# Altium project PowerBoard.PrjPcb (part 1 of 2)
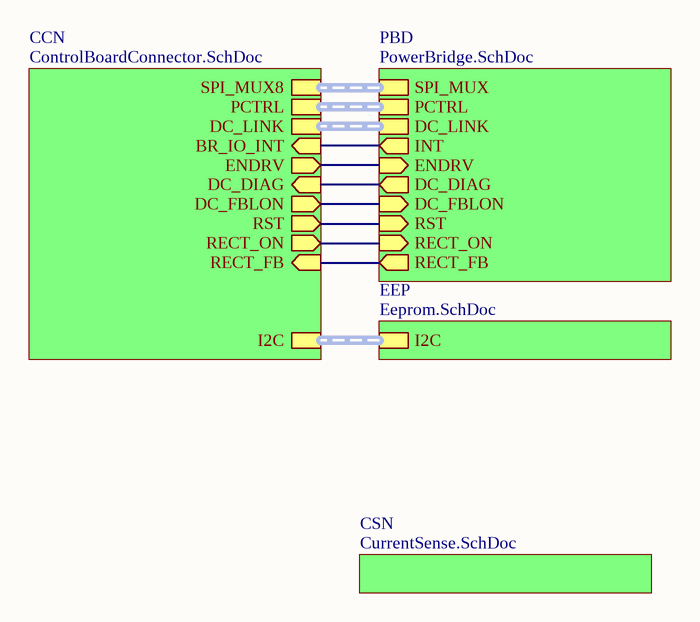
[diagram p0: Top.SchDoc]
14 sheets, 423 parts. Net scope: hierarchical (ports join the sheet entries above them; power ports are global).
Board file: PowerBoard.PcbDoc
Sheets:
  Top.SchDoc
    CCN = ControlBoardConnector.SchDoc
    PBD = PowerBridge.SchDoc
      HBU = HalfBridgeDriver.SchDoc
        DRVH = Driver.SchDoc
          ISU = IsoSupply.SchDoc
        DRVL = Driver.SchDoc
          ISU = IsoSupply.SchDoc
      HBW = HalfBridgeDriver.SchDoc
        DRVH = Driver.SchDoc
          ISU = IsoSupply.SchDoc
        DRVL = Driver.SchDoc
          ISU = IsoSupply.SchDoc
      IOE = IoExpander.SchDoc
      SMX = SpiMux.SchDoc
      TAD = TempAdc.SchDoc
        IS1 = CurrentSource.SchDoc
        IS2 = CurrentSource.SchDoc
        IS3 = CurrentSource.SchDoc
        IS4 = CurrentSource.SchDoc
      DCL = DcLink.SchDoc
      ANG = AndGate.SchDoc
      HBV = HalfBridgeDriver.SchDoc
        DRVH = Driver.SchDoc
          ISU = IsoSupply.SchDoc
        DRVL = Driver.SchDoc
          ISU = IsoSupply.SchDoc
      RCFR = Rectifier.SchDoc
    CSN = CurrentSense.SchDoc

## Sheet Top.SchDoc
size A4; DocumentNumber: 11; SheetNumber: 1; SheetTotal: 14

### Sub-sheets
CCN = ControlBoardConnector.SchDoc: SPI_MUX8 (harness SPI_MUX8), PCTRL (harness PCTRL), DC_LINK (harness DC_LINK), BR_IO_INT (in), DC_FBLON (out), DC_DIAG (in), ENDRV (out), RST (out), RECT_ON (out), RECT_FB (in), I2C (harness I2C)
CSN = CurrentSense.SchDoc: no entries
EEP = Eeprom.SchDoc (file not in this document): I2C (harness I2C)
PBD = PowerBridge.SchDoc: SPI_MUX (harness SPI_MUX8), INT (out), PCTRL (harness PCTRL), DC_LINK (harness DC_LINK), ENDRV (in), DC_DIAG (out), DC_FBLON (in), RST (in), RECT_ON (in), RECT_FB (out)

### Nets
NetFBON_1: sheet CCN/DC_FBLON, sheet PBD/DC_FBLON
NetP1_39: sheet CCN/BR_IO_INT, sheet PBD/INT
NetP1_40: sheet CCN/ENDRV, sheet PBD/ENDRV
NetP1_41: sheet CCN/RST, sheet PBD/RST
NetP1_42: sheet CCN/DC_DIAG, sheet PBD/DC_DIAG
NetP1_52: sheet CCN/RECT_ON, sheet PBD/RECT_ON
NetP1_53: sheet CCN/RECT_FB, sheet PBD/RECT_FB

### Buses and harness runs
harness sheet CCN/DC_LINK = sheet PBD/DC_LINK
harness sheet CCN/I2C = sheet EEP/I2C
harness sheet CCN/PCTRL = sheet PBD/PCTRL
harness sheet CCN/SPI_MUX8 = sheet PBD/SPI_MUX

## Sheet ControlBoardConnector.SchDoc
size A4; DocumentNumber: 10; SheetNumber: 13; SheetTotal: 15
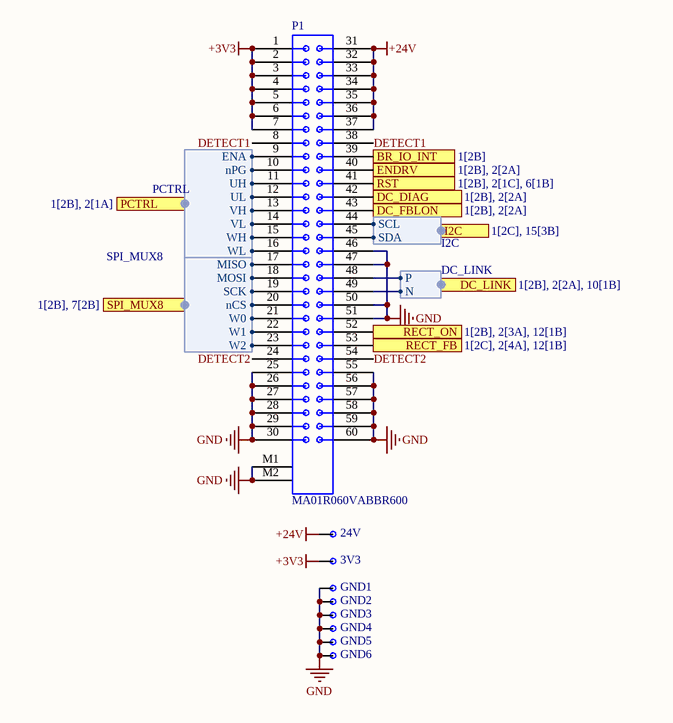
[diagram p1: ControlBoardConnector.SchDoc]

### Parts
3V3  Testpoint  [Testpoint-Footprint-1]  (value not drawn)  (no BOM)
24V  Testpoint  [Testpoint-Footprint-1]  (value not drawn)  (no BOM)
GND1  Testpoint  [Testpoint-Footprint-1]  (value not drawn)  (no BOM)
GND2  Testpoint  [Testpoint-Footprint-1]  (value not drawn)  (no BOM)
GND3  Testpoint  [Testpoint-Footprint-1]  (value not drawn)  (no BOM)
GND4  Testpoint  [Testpoint-Footprint-1]  (value not drawn)  (no BOM)
GND5  Testpoint  [Testpoint-Footprint-1]  (value not drawn)  (no BOM)
GND6  Testpoint  [Testpoint-Footprint-1]  (value not drawn)  (no BOM)
P1  MA01R060VABBR600  [MA01F060VABBR300-Footprint-1]

### Ports
BR_IO_INT (in, see 1[2B]), DC_DIAG (in, see 1[2B], 2[2A]), DC_FBLON (out, see 1[2B], 2[2A]), DC_LINK (out, harness DC_LINK, see 1[2B], 2[2A], 10[1B]), ENDRV (out, see 1[2B], 2[2A]), I2C (harness I2C, see 1[2C], 15[3B]), PCTRL (harness PCTRL, see 1[2B], 2[1A]), RECT_FB (in, see 1[2C], 2[4A], 12[1B]), RECT_ON (out, see 1[2B], 2[3A], 12[1B]), RST (out, see 1[2B], 2[1C], 6[1B]), SPI_MUX8 (harness SPI_MUX8, see 1[2B], 7[2B])

### Harnesses
SPI_MUX8: nCS, SCK, MISO, MOSI, W0, W1, W2
PCTRL: UH, UL, VH, VL, WH, WL, ENA, nPG
DC_LINK: P, N
I2C: SDA, SCL

### Nets
+3V3: 3V3.1 P1.1 P1.2 P1.3 P1.4 P1.5 P1.6 P1.7
+24V: 24V.1 P1.31 P1.32 P1.33 P1.34 P1.35 P1.36 P1.37
GND: GND1.1 GND2.1 GND3.1 GND4.1 GND5.1 GND6.1 P1.25 P1.26 P1.27 P1.28 P1.29 P1.30 P1.46 P1.47 P1.50 P1.51 P1.55 P1.56 P1.57 P1.58 P1.59 P1.60 P1.M1 P1.M2
CTRL_ENA: P1.9 ; port PCTRL.ENA
CTRL_nPG: P1.10 ; port PCTRL.nPG
DETECT1: P1.8 P1.38
DETECT2: P1.24 P1.54
PWM_UH: P1.11 ; port PCTRL.UH
PWM_UL: P1.12 ; port PCTRL.UL
PWM_VH: P1.13 ; port PCTRL.VH
PWM_VL: P1.14 ; port PCTRL.VL
PWM_WH: P1.15 ; port PCTRL.WH
PWM_WL: P1.16 ; port PCTRL.WL
NetC36_1: P1.48 ; port DC_LINK.P
NetC36_2: P1.49 ; port DC_LINK.N
NetFBON_1: P1.43 ; port DC_FBLON
NetP1_17: P1.17 ; port SPI_MUX8.MISO
NetP1_18: P1.18 ; port SPI_MUX8.MOSI
NetP1_19: P1.19 ; port SPI_MUX8.SCK
NetP1_20: P1.20 ; port SPI_MUX8.nCS
NetP1_21: P1.21 ; port SPI_MUX8.W0
NetP1_22: P1.22 ; port SPI_MUX8.W1
NetP1_23: P1.23 ; port SPI_MUX8.W2
NetP1_39: P1.39 ; port BR_IO_INT
NetP1_40: P1.40 ; port ENDRV
NetP1_41: P1.41 ; port RST
NetP1_42: P1.42 ; port DC_DIAG
NetP1_44: P1.44 ; port I2C.SCL
NetP1_45: P1.45 ; port I2C.SDA
NetP1_52: P1.52 ; port RECT_ON
NetP1_53: P1.53 ; port RECT_FB

### Library data of the parts
3V3 24V GND1-GND6 = CMP-003-000002-1
P1 = CMP-002-00095-1: Right-angle Dual Port D-Sub Connector

## Sheet PowerBridge.SchDoc
size A4; DocumentNumber: 1; SheetNumber: 2; SheetTotal: 14
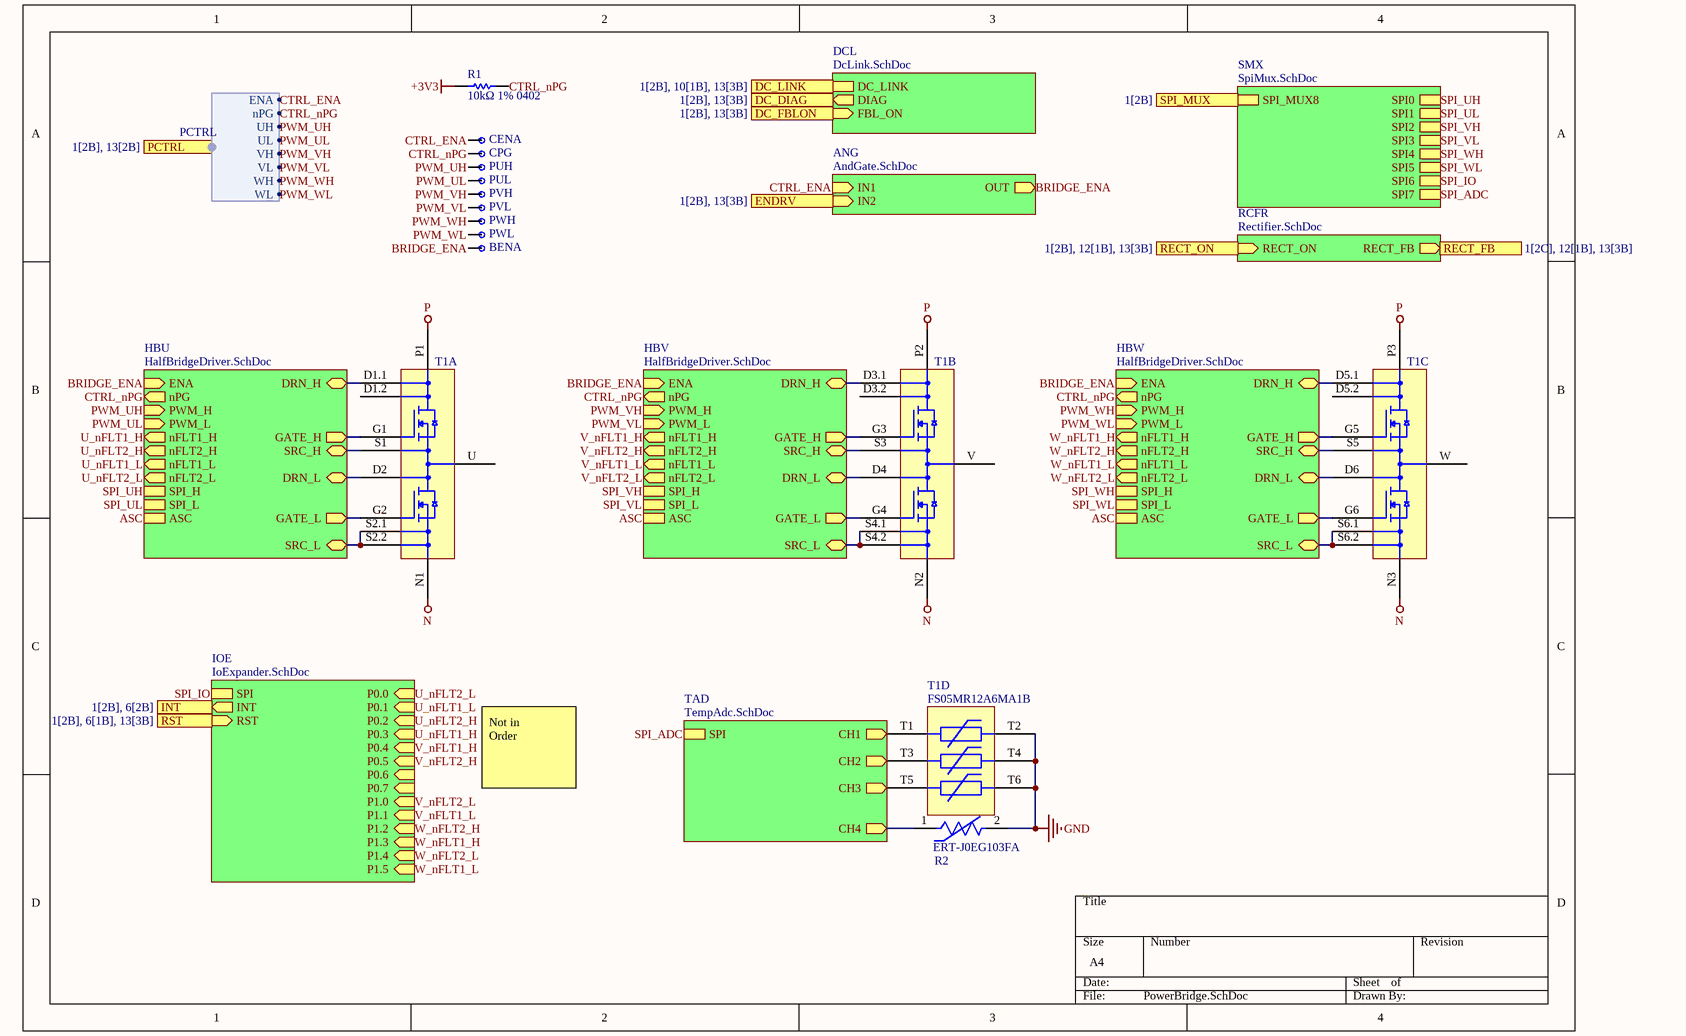
[diagram p2: PowerBridge.SchDoc]

### Parts
BENA  Testpoint  [Testpoint-Footprint-1]  (value not drawn)  (no BOM)
CENA  Testpoint  [Testpoint-Footprint-1]  (value not drawn)  (no BOM)
CPG  Testpoint  [Testpoint-Footprint-1]  (value not drawn)  (no BOM)
PUH  Testpoint  [Testpoint-Footprint-1]  (value not drawn)  (no BOM)
PUL  Testpoint  [Testpoint-Footprint-1]  (value not drawn)  (no BOM)
PVH  Testpoint  [Testpoint-Footprint-1]  (value not drawn)  (no BOM)
PVL  Testpoint  [Testpoint-Footprint-1]  (value not drawn)  (no BOM)
PWH  Testpoint  [Testpoint-Footprint-1]  (value not drawn)  (no BOM)
PWL  Testpoint  [Testpoint-Footprint-1]  (value not drawn)  (no BOM)
R1  10kΩ 1% 0402  [0402N]
R2  ERT-J0EG103FA  [FP-ERTJ0-MFG]
T1  FS05MR12A6MA1B  [FS05MR12A6MA1B-Footprint-1]  (value not drawn)  (parts A,B,C,D of 4)

### Sub-sheets
ANG = AndGate.SchDoc: IN1 (in), IN2 (in), OUT (out)
DCL = DcLink.SchDoc: DC_LINK (harness DC_LINK), DIAG (out), FBL_ON (in)
HBU = HalfBridgeDriver.SchDoc: PWM_H (in), PWM_L (in), SRC_H (bidir), SRC_L (bidir), DRN_H (bidir), GATE_H (out), GATE_L (out), nFLT1_H (out), nFLT2_H (out), nFLT1_L (out), nFLT2_L (out), SPI_H (harness SPI), SPI_L (harness SPI), ASC (harness ASC), ENA (in), nPG (out), DRN_L (bidir)
HBV = HalfBridgeDriver.SchDoc: PWM_H (in), PWM_L (in), GATE_H (out), GATE_L (out), nFLT1_H (out), nFLT2_H (out), nFLT1_L (out), nFLT2_L (out), SPI_H (harness SPI), SPI_L (harness SPI), ASC (harness ASC), ENA (in), nPG (out), SRC_H (bidir), SRC_L (bidir), DRN_H (bidir), DRN_L (bidir)
HBW = HalfBridgeDriver.SchDoc: PWM_H (in), PWM_L (in), GATE_H (out), GATE_L (out), nFLT1_H (out), nFLT2_H (out), nFLT1_L (out), nFLT2_L (out), SPI_H (harness SPI), SPI_L (harness SPI), ASC (harness ASC), ENA (in), nPG (out), SRC_H (bidir), SRC_L (bidir), DRN_H (bidir), DRN_L (bidir)
IOE = IoExpander.SchDoc: P0.0 (in), P0.1 (in), P0.2 (in), P0.3 (in), P0.4 (in), P0.5 (in), P0.6 (in), P0.7 (in), P1.0 (in), P1.1 (in), P1.2 (in), P1.3 (in), P1.4 (in), P1.5 (in), INT (out), SPI (harness SPI), RST (in)
RCFR = Rectifier.SchDoc: RECT_ON (in), RECT_FB (out)
SMX = SpiMux.SchDoc: SPI_MUX8 (harness SPI_MUX8), SPI0 (harness SPI), SPI1 (harness SPI), SPI2 (harness SPI), SPI3 (harness SPI), SPI4 (harness SPI), SPI5 (harness SPI), SPI6 (harness SPI), SPI7 (harness SPI)
TAD = TempAdc.SchDoc: CH1 (out), CH2 (out), CH3 (out), CH4 (out), SPI (harness SPI)

### Ports
DC_DIAG (out, see 1[2B], 13[3B]), DC_FBLON (in, see 1[2B], 13[3B]), DC_LINK (harness DC_LINK, see 1[2B], 10[1B], 13[3B]), ENDRV (in, see 1[2B], 13[3B]), INT (out, see 1[2B], 6[2B]), PCTRL (harness PCTRL, see 1[2B], 13[2B]), RECT_FB (out, see 1[2C], 12[1B], 13[3B]), RECT_ON (in, see 1[2B], 12[1B], 13[3B]), RST (in, see 1[2B], 6[1B], 13[3B]), SPI_MUX (harness SPI_MUX8, see 1[2B])

### Harnesses
PCTRL: UH, UL, VH, VL, WH, WL, ENA, nPG

### Nets
+3V3: R1.1
GND: R2.2 T1.T2(PIN) T1.T4(PIN) T1.T6(PIN)
N: T1.N1(PIN) T1.N2(PIN) T1.N3(PIN)
P: T1.P1(PIN) T1.P2(PIN) T1.P3(PIN)
BRIDGE_ENA: BENA.1 ; sheet HBU/ENA, sheet HBW/ENA, sheet ANG/OUT, sheet HBV/ENA
CTRL_ENA: CENA.1 ; sheet ANG/IN1, port PCTRL.ENA
CTRL_nPG: CPG.1 R1.2 ; sheet HBU/nPG, sheet HBW/nPG, sheet HBV/nPG, port PCTRL.nPG
DRV_COM: T1.S2.1(PIN) T1.S2.2(PIN) ; sheet HBU/SRC_L
DRV_COM: T1.S1(PIN) ; sheet HBU/SRC_H  [a separate net that carries the same name]
DRV_COM: T1.S4.1(PIN) T1.S4.2(PIN) ; sheet HBV/SRC_L  [a separate net that carries the same name]
DRV_COM: T1.S3(PIN) ; sheet HBV/SRC_H  [a separate net that carries the same name]
DRV_COM: T1.S6.1(PIN) T1.S6.2(PIN) ; sheet HBW/SRC_L  [a separate net that carries the same name]
DRV_COM: T1.S5(PIN) ; sheet HBW/SRC_H  [a separate net that carries the same name]
PWM_UH: PUH.1 ; sheet HBU/PWM_H, port PCTRL.UH
PWM_UL: PUL.1 ; sheet HBU/PWM_L, port PCTRL.UL
PWM_VH: PVH.1 ; sheet HBV/PWM_H, port PCTRL.VH
PWM_VL: PVL.1 ; sheet HBV/PWM_L, port PCTRL.VL
PWM_WH: PWH.1 ; sheet HBW/PWM_H, port PCTRL.WH
PWM_WL: PWL.1 ; sheet HBW/PWM_L, port PCTRL.WL
U_nFLT1_H: sheet HBU/nFLT1_H, sheet IOE/P0.3
U_nFLT1_L: sheet HBU/nFLT1_L, sheet IOE/P0.1
U_nFLT2_H: sheet HBU/nFLT2_H, sheet IOE/P0.2
U_nFLT2_L: sheet HBU/nFLT2_L, sheet IOE/P0.0
V_nFLT1_H: sheet IOE/P0.4, sheet HBV/nFLT1_H
V_nFLT1_L: sheet IOE/P1.1, sheet HBV/nFLT1_L
V_nFLT2_H: sheet IOE/P0.5, sheet HBV/nFLT2_H
V_nFLT2_L: sheet IOE/P1.0, sheet HBV/nFLT2_L
W_nFLT1_H: sheet HBW/nFLT1_H, sheet IOE/P1.3
W_nFLT1_L: sheet HBW/nFLT1_L, sheet IOE/P1.5
W_nFLT2_H: sheet HBW/nFLT2_H, sheet IOE/P1.2
W_nFLT2_L: sheet HBW/nFLT2_L, sheet IOE/P1.4
NetD1_PBD_HBU_DRVH_1: T1.D1.1(PIN) ; sheet HBU/DRN_H
NetD1_PBD_HBU_DRVL_1: T1.D2(PIN) ; sheet HBU/DRN_L
NetD1_PBD_HBV_DRVH_1: T1.D3.1(PIN) ; sheet HBV/DRN_H
NetD1_PBD_HBV_DRVL_1: T1.D4(PIN) ; sheet HBV/DRN_L
NetD1_PBD_HBW_DRVH_1: T1.D5.1(PIN) ; sheet HBW/DRN_H
NetD1_PBD_HBW_DRVL_1: T1.D6(PIN) ; sheet HBW/DRN_L
NetD3_PBD_HBU_DRVH_1: T1.G1(PIN) ; sheet HBU/GATE_H
NetD3_PBD_HBU_DRVL_1: T1.G2(PIN) ; sheet HBU/GATE_L
NetD3_PBD_HBV_DRVH_1: T1.G3(PIN) ; sheet HBV/GATE_H
NetD3_PBD_HBV_DRVL_1: T1.G4(PIN) ; sheet HBV/GATE_L
NetD3_PBD_HBW_DRVH_1: T1.G5(PIN) ; sheet HBW/GATE_H
NetD3_PBD_HBW_DRVL_1: T1.G6(PIN) ; sheet HBW/GATE_L
NetFBON_1: port DC_FBLON, sheet DCL/FBL_ON
NetP1_39: port INT, sheet IOE/INT
NetP1_40: port ENDRV, sheet ANG/IN2
NetP1_41: port RST, sheet IOE/RST
NetP1_42: port DC_DIAG, sheet DCL/DIAG
NetP1_52: port RECT_ON, sheet RCFR/RECT_ON
NetP1_53: port RECT_FB, sheet RCFR/RECT_FB
NetR2_1: R2.1 ; sheet TAD/CH4
NetR16_IS1_2: T1.T1(PIN) ; sheet TAD/CH1
NetR16_IS2_2: T1.T3(PIN) ; sheet TAD/CH2
NetR16_IS3_2: T1.T5(PIN) ; sheet TAD/CH3

Not connected (* = marked no-connect by the designer): T1 D1.2(PIN) D3.2(PIN) D5.2(PIN) U(PIN) V(PIN) W(PIN)

### Buses and harness runs
harness port DC_LINK = sheet DCL/DC_LINK
harness port SPI_MUX = sheet SMX/SPI_MUX8

### Notes on the sheet
- Not in
  Order
- Labels drawn without touching a wire or pin: ASC, SPI_ADC, SPI_IO, SPI_UH, SPI_UL, SPI_VH, SPI_VL, SPI_WH, SPI_WL

### Library data of the parts
BENA CENA CPG PUH PUL PVH PVL PWH PWL = CMP-003-000002-1
R1 = R0402: Resistance: 10k; Tolerance: 1; Footprint: 0402
R2 = CMP-2002-01179-2: THERMISTOR NTC 10KOHM 3380K 0402; Power Rating: 66mW; Accuracy: 1%; Resistance: 10kR; Mount: Surface Mount; Radiation Hardening: No; Case Code (Metric): 1005; Termination: SMD/SMT; Width: 500um; Packaging: Tape and Reel; Case Code (Imperial): 0402; Depth: 0.5mm; Max Operating Temperature: 125°C; REACH SVHC: No SVHC; Case/Package: 0402; RoHS Compliant: Yes; Lead Free: Lead Free; Package Quantity: 1; Min Operating Temperature: -40°C; Tolerance: 1%; Resistance Tolerance: 1%; Height: 0.5mm; Contact Plating: Tin; Series: ERT-J; Max Power Dissipation: 66mW; Number of Pins: 2; Length: 1mm
T1 = CMP-013-00039-2: HybridPACK™ Drive module with CoolSiC™ Automotive MOSFET

## Sheet HalfBridgeDriver.SchDoc
size A4; DocumentNumber: 5; SheetNumber: 3; SheetTotal: 15
Used 3 times, as channels PBD/HBU, PBD/HBW, PBD/HBV. Parts and nets are listed once, with the designators drawn on the sheet.
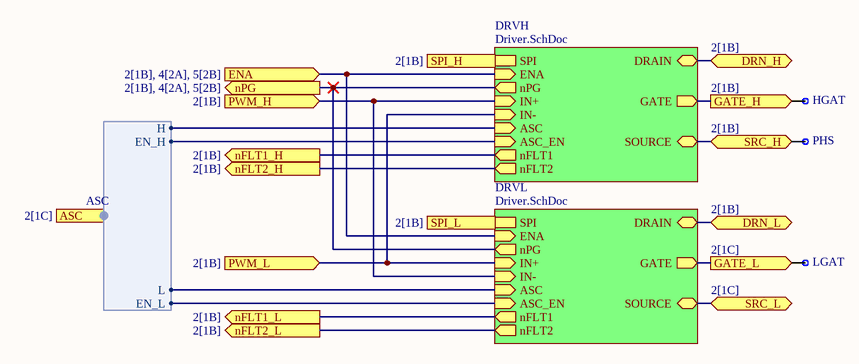
[diagram p3: HalfBridgeDriver.SchDoc]

### Parts
HGAT  Testpoint  [Testpoint-Footprint-1]  (value not drawn)  (no BOM)
LGAT  Testpoint  [Testpoint-Footprint-1]  (value not drawn)  (no BOM)
PHS  Testpoint  [Testpoint-Footprint-1]  (value not drawn)  (no BOM)

### Sub-sheets
DRVH = Driver.SchDoc: SPI (harness SPI), IN+ (in), IN- (in), ASC (in), ASC_EN (in), nFLT1 (out), nFLT2 (out), GATE (out), DRAIN (bidir), SOURCE (bidir), ENA (in), nPG (out)
DRVL = Driver.SchDoc: SPI (harness SPI), IN+ (in), IN- (in), ASC (in), ASC_EN (in), nFLT1 (out), nFLT2 (out), GATE (out), DRAIN (bidir), SOURCE (bidir), ENA (in), nPG (out)

### Ports
ASC (harness ASC, see 2[1C]), DRN_H (bidir, see 2[1B]), DRN_L (bidir, see 2[1B]), ENA (in, see 2[1B], 4[2A], 5[2B]), GATE_H (out, see 2[1B]), GATE_L (out, see 2[1C]), nFLT1_H (out, see 2[1B]), nFLT1_L (out, see 2[1B]), nFLT2_H (out, see 2[1B]), nFLT2_L (out, see 2[1B]), nPG (out, see 2[1B], 4[2A], 5[2B]), PWM_H (in, see 2[1B]), PWM_L (in, see 2[1B]), SPI_H (harness SPI, see 2[1B]), SPI_L (harness SPI, see 2[1B]), SRC_H (bidir, see 2[1B]), SRC_L (bidir, see 2[1C])

### Harnesses
ASC: H, EN_H, L, EN_L

### Nets
DRN_H: port DRN_H, sheet DRVH/DRAIN
DRN_L: port DRN_L, sheet DRVL/DRAIN
ENA: port ENA, sheet DRVH/ENA, sheet DRVL/ENA
GATE_H: HGAT.1 ; port GATE_H, sheet DRVH/GATE
GATE_L: LGAT.1 ; port GATE_L, sheet DRVL/GATE
nFLT1_H: port nFLT1_H, sheet DRVH/nFLT1
nFLT1_L: port nFLT1_L, sheet DRVL/nFLT1
nFLT2_H: port nFLT2_H, sheet DRVH/nFLT2
nFLT2_L: port nFLT2_L, sheet DRVL/nFLT2
nPG: port nPG, sheet DRVH/nPG, sheet DRVL/nPG
PWM_H: port PWM_H, sheet DRVH/IN+, sheet DRVL/IN-
PWM_L: port PWM_L, sheet DRVH/IN-, sheet DRVL/IN+
SRC_H: PHS.1 ; port SRC_H, sheet DRVH/SOURCE
SRC_L: port SRC_L, sheet DRVL/SOURCE
(unnamed): sheet DRVH/ASC, port ASC.H
(unnamed): sheet DRVH/ASC_EN, port ASC.EN_H
(unnamed): sheet DRVL/ASC, port ASC.L
(unnamed): sheet DRVL/ASC_EN, port ASC.EN_L

### Channels
PBD/HBU: designators end in _HBU; ports DRN_H=NetD1_PBD_HBU_DRVH_1 DRN_L=NetD1_PBD_HBU_DRVL_1 ENA=BRIDGE_ENA GATE_H=NetD3_PBD_HBU_DRVH_1 GATE_L=NetD3_PBD_HBU_DRVL_1 nFLT1_H=U_nFLT1_H nFLT1_L=U_nFLT1_L nFLT2_H=U_nFLT2_H nFLT2_L=U_nFLT2_L nPG=CTRL_nPG PWM_H=PWM_UH PWM_L=PWM_UL SRC_H=DRV_COM SRC_L=DRV_COM
PBD/HBW: designators end in _HBW; ports DRN_H=NetD1_PBD_HBW_DRVH_1 DRN_L=NetD1_PBD_HBW_DRVL_1 ENA=BRIDGE_ENA GATE_H=NetD3_PBD_HBW_DRVH_1 GATE_L=NetD3_PBD_HBW_DRVL_1 nFLT1_H=W_nFLT1_H nFLT1_L=W_nFLT1_L nFLT2_H=W_nFLT2_H nFLT2_L=W_nFLT2_L nPG=CTRL_nPG PWM_H=PWM_WH PWM_L=PWM_WL SRC_H=DRV_COM SRC_L=DRV_COM
PBD/HBV: designators end in _HBV; ports DRN_H=NetD1_PBD_HBV_DRVH_1 DRN_L=NetD1_PBD_HBV_DRVL_1 ENA=BRIDGE_ENA GATE_H=NetD3_PBD_HBV_DRVH_1 GATE_L=NetD3_PBD_HBV_DRVL_1 nFLT1_H=V_nFLT1_H nFLT1_L=V_nFLT1_L nFLT2_H=V_nFLT2_H nFLT2_L=V_nFLT2_L nPG=CTRL_nPG PWM_H=PWM_VH PWM_L=PWM_VL SRC_H=DRV_COM SRC_L=DRV_COM

### Buses and harness runs
harness port SPI_H = sheet DRVH/SPI
harness port SPI_L = sheet DRVL/SPI

### Library data of the parts
HGAT LGAT PHS = CMP-003-000002-1

## Sheet Driver.SchDoc
size A4; DocumentNumber: 2; SheetNumber: 4; SheetTotal: 15
Used 6 times, as channels PBD/HBU/DRVH, PBD/HBU/DRVL, PBD/HBW/DRVH, PBD/HBW/DRVL, PBD/HBV/DRVH, PBD/HBV/DRVL. Parts and nets are listed once, with the designators drawn on the sheet.
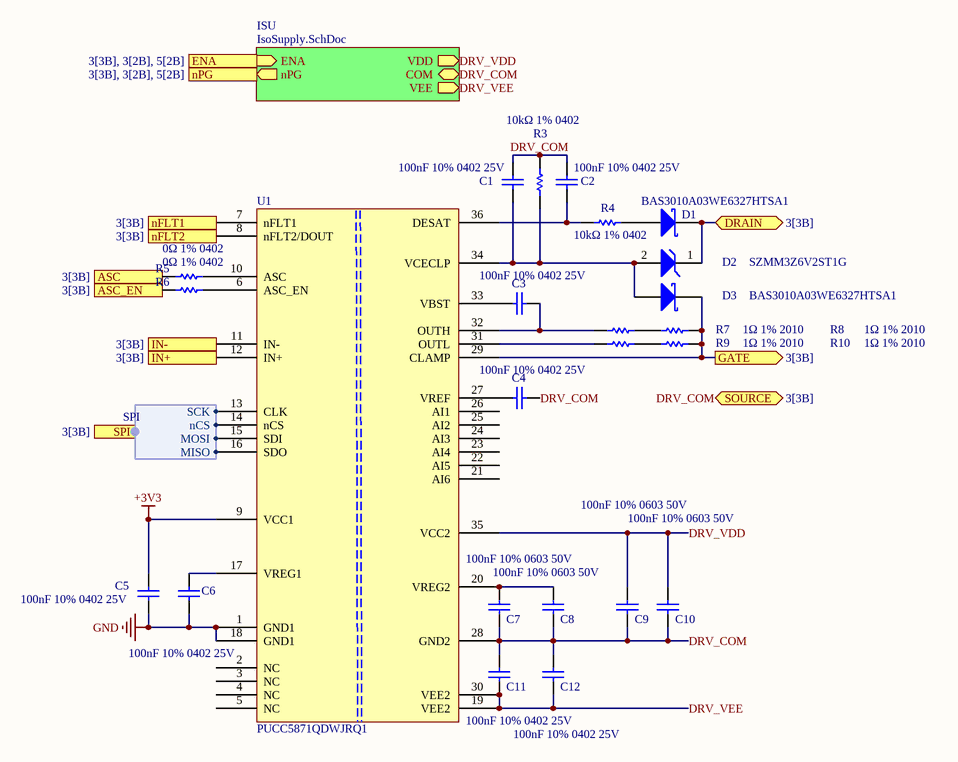
[diagram p4: Driver.SchDoc]

### Parts
C1  100nF 10% 0402 25V  [0402N]
C2  100nF 10% 0402 25V  [0402N]
C3  100nF 10% 0402 25V  [0402N]
C4  100nF 10% 0402 25V  [0402N]
C5  100nF 10% 0402 25V  [0402N]
C6  100nF 10% 0402 25V  [0402N]
C7  100nF 10% 0603 50V  [0603N]
C8  100nF 10% 0603 50V  [0603N]
C9  100nF 10% 0603 50V  [0603N]
C10  100nF 10% 0603 50V  [0603N]
C11  100nF 10% 0402 25V  [0402N]
C12  100nF 10% 0402 25V  [0402N]
D1  BAS3010A03WE6327HTSA1  [INF-SOD323_V]
D2  SZMM3Z6V2ST1G  [ONSC-SOD-323-2-477-02_V]
D3  BAS3010A03WE6327HTSA1  [INF-SOD323_V]
R3  10kΩ 1% 0402  [0402N]
R4  10kΩ 1% 0402  [0402N]
R5  0Ω 1% 0402  [0402N]
R6  0Ω 1% 0402  [0402N]
R7  1Ω 1% 2010  [2010N]
R8  1Ω 1% 2010  [2010N]
R9  1Ω 1% 2010  [2010N]
R10  1Ω 1% 2010  [2010N]
U1  PUCC5871QDWJRQ1  [PUCC5871QDWJRQ1-Footprint-1]

### Sub-sheets
ISU = IsoSupply.SchDoc: VDD (out), VEE (out), COM (bidir), ENA (in), nPG (out)

### Ports
ASC (in, see 3[3B]), ASC_EN (in, see 3[3B]), DRAIN (bidir, see 3[3B]), ENA (in, see 3[3B], 3[2B], 5[2B]), GATE (out, see 3[3B]), IN+ (in, see 3[3B]), IN- (in, see 3[3B]), nFLT1 (out, see 3[3B]), nFLT2 (out, see 3[3B]), nPG (out, see 3[3B], 3[2B], 5[2B]), SOURCE (bidir, see 3[3B]), SPI (harness SPI, see 3[3B])

### Harnesses
SPI: nCS, SCK, MISO, MOSI

### Nets
+3V3: C5.2 U1.9(VCC1)
GND: C5.1 C6.1 U1.1(GND1) U1.18(GND1)
ASC: R5.1 ; port ASC
ASC_EN: R6.1 ; port ASC_EN
DRAIN: D1.1(K) D2.1(K) ; port DRAIN
DRV_COM: C1.2 C2.2 C4.1 C7.2 C8.2 C9.2 C10.2 C11.1 C12.1 R3.1 U1.28(GND2) ; port SOURCE, sheet ISU/COM
DRV_VDD: C9.1 C10.1 U1.35(VCC2) ; sheet ISU/VDD
DRV_VEE: C11.2 C12.2 U1.19(VEE2) U1.30(VEE2) ; sheet ISU/VEE
ENA: port ENA, sheet ISU/ENA
GATE: D3.1(K) R8.2 R10.2 U1.29(CLAMP) ; port GATE
IN+: U1.12(IN+) ; port IN+
IN-: U1.11(IN-) ; port IN-
nFLT1: U1.7(nFLT1) ; port nFLT1
nFLT2: U1.8(nFLT2/DOUT) ; port nFLT2
nPG: port nPG, sheet ISU/nPG
NetC1_1: C1.1 D2.2(A) D3.2(A) R3.2 U1.34(VCECLP)
NetC2_1: C2.1 R4.2 U1.36(DESAT)
NetC3_1: C3.1 R7.1 U1.32(OUTH)
NetC3_2: C3.2 U1.33(VBST)
NetC4_2: C4.2 U1.27(VREF)
NetC6_2: C6.2 U1.17(VREG1)
NetC7_1: C7.1 C8.1 U1.20(VREG2)
NetD1_2: D1.2(A) R4.1
NetR5_2: R5.2 U1.10(ASC)
NetR6_2: R6.2 U1.6(ASC_EN)
NetR7_2: R7.2 R8.1
NetR9_1: R9.1 U1.31(OUTL)
NetR9_2: R9.2 R10.1
NetU1_13: U1.13(CLK) ; port SPI.SCK
NetU1_14: U1.14(nCS) ; port SPI.nCS
NetU1_15: U1.15(SDI) ; port SPI.MOSI
NetU1_16: U1.16(SDO) ; port SPI.MISO

Not connected (* = marked no-connect by the designer): U1 2(NC) 3(NC) 4(NC) 5(NC) 21(AI6) 22(AI5) 23(AI4) 24(AI3) 25(AI2) 26(AI1)

### Channels
PBD/HBU/DRVH: designators end in _PBD_HBU_DRVH; ports ASC=NetR5_PBD_HBU_DRVH_1 ASC_EN=NetR6_PBD_HBU_DRVH_1 DRAIN=NetD1_PBD_HBU_DRVH_1 ENA=BRIDGE_ENA GATE=NetD3_PBD_HBU_DRVH_1 IN+=PWM_UH IN-=PWM_UL nFLT1=U_nFLT1_H nFLT2=U_nFLT2_H nPG=CTRL_nPG SOURCE=DRV_COM
PBD/HBU/DRVL: designators end in _PBD_HBU_DRVL; ports ASC=NetR5_PBD_HBU_DRVL_1 ASC_EN=NetR6_PBD_HBU_DRVL_1 DRAIN=NetD1_PBD_HBU_DRVL_1 ENA=BRIDGE_ENA GATE=NetD3_PBD_HBU_DRVL_1 IN+=PWM_UL IN-=PWM_UH nFLT1=U_nFLT1_L nFLT2=U_nFLT2_L nPG=CTRL_nPG SOURCE=DRV_COM
PBD/HBW/DRVH: designators end in _PBD_HBW_DRVH; ports ASC=NetR5_PBD_HBW_DRVH_1 ASC_EN=NetR6_PBD_HBW_DRVH_1 DRAIN=NetD1_PBD_HBW_DRVH_1 ENA=BRIDGE_ENA GATE=NetD3_PBD_HBW_DRVH_1 IN+=PWM_WH IN-=PWM_WL nFLT1=W_nFLT1_H nFLT2=W_nFLT2_H nPG=CTRL_nPG SOURCE=DRV_COM
PBD/HBW/DRVL: designators end in _PBD_HBW_DRVL; ports ASC=NetR5_PBD_HBW_DRVL_1 ASC_EN=NetR6_PBD_HBW_DRVL_1 DRAIN=NetD1_PBD_HBW_DRVL_1 ENA=BRIDGE_ENA GATE=NetD3_PBD_HBW_DRVL_1 IN+=PWM_WL IN-=PWM_WH nFLT1=W_nFLT1_L nFLT2=W_nFLT2_L nPG=CTRL_nPG SOURCE=DRV_COM
PBD/HBV/DRVH: designators end in _PBD_HBV_DRVH; ports ASC=NetR5_PBD_HBV_DRVH_1 ASC_EN=NetR6_PBD_HBV_DRVH_1 DRAIN=NetD1_PBD_HBV_DRVH_1 ENA=BRIDGE_ENA GATE=NetD3_PBD_HBV_DRVH_1 IN+=PWM_VH IN-=PWM_VL nFLT1=V_nFLT1_H nFLT2=V_nFLT2_H nPG=CTRL_nPG SOURCE=DRV_COM
PBD/HBV/DRVL: designators end in _PBD_HBV_DRVL; ports ASC=NetR5_PBD_HBV_DRVL_1 ASC_EN=NetR6_PBD_HBV_DRVL_1 DRAIN=NetD1_PBD_HBV_DRVL_1 ENA=BRIDGE_ENA GATE=NetD3_PBD_HBV_DRVL_1 IN+=PWM_VL IN-=PWM_VH nFLT1=V_nFLT1_L nFLT2=V_nFLT2_L nPG=CTRL_nPG SOURCE=DRV_COM

### Library data of the parts
C1-C6 C11 C12 = C0402: Capacitance: 100n; Tolerance: 10; Voltage: 25; Footprint: 0402
C7-C10 = C0603: Capacitance: 100n; Tolerance: 10; Voltage: 50; Footprint: 0603
D1 D3 = CMP-2000-05919-1: Medium Power AF Schottky Diode, 0.41 V, 1 A, -65 to 125 degC, 2-Pin SOD323, RoHS, Tape and Reel; Manufacturer: Infineon; Lead Finish: Tin; Peak Average Forward Current: 1A; Peak Reverse Repetitive Voltage: 30V; Max Processing Temp: 260; Configuration: Single; Screening Level: Automotive; Package Reference: SOD323; Package Description: 2-Pin Small Outline Diode Package, Body 1.25 x 1.7 mm; Manufacturer URL: http://www.infineon.com/; Mounting: SurfaceMount; Mounting Technology: SurfaceMount; Datasheet URL: http://www.infineon.com/dgdl/Infineon-BAS3010ASERIES-DS-v01_01-en.pdf?fileId=db3a30431ddc9372011dfbc50f231c06; Type: SchottkyDiode; Datasheet Version: 04/2007; Operating Temperature: -65to125C; Package URL: http://www.infineon.com/dgdl/SOD323-Package_Overview.pdf?folderId=db3a30431936bc4b011952aab84f3bbe&fileId=db3a30431936bc4b011952beed653be3
D2 = CMP-1060-00681-1: Zener Voltage Regulator, 300 mW, Tight Tolerance Portfolio, 2-Pin SOD-323, Pb-Free, Tape and Reel; Manufacturer: On Semiconductor; P Max (W): 0.3; PartNumber: SZMM3Z6V2ST1G; PackageVersion: Rev. H, 03/2007; RoHS: Pb-Free; ComponentLink1URL: http://www.onsemi.com/; PackageReference: SOD-323-2-477-02; PackageDescription: 2-Pin SOD, Body 1.7 x 1.25 mm; ComponentLink1Description: Manufacturer URL; DatasheetVersion: Rev. 21; Mounting Technology: Surface Mount; ComponentLink2URL: http://www.onsemi.cn/pub_link/Collateral/MM3Z2V4ST1-D.PDF; ComponentLink2Description: Datasheet; ComponentLink3URL: http://www.onsemi.com/pub_link/Collateral/477-02.PDF.1; ComponentLink3Description: Package Specification; Packing: Tape and Reel
R3 R4 = R0402: Resistance: 10k; Tolerance: 1; Footprint: 0402
R5 R6 = R0402: Resistance: 0; Tolerance: 1; Footprint: 0402
R7-R10 = R2010: Resistance: 1; Tolerance: 1; Footprint: 2010
U1 = CMP-00024-00006-2: Automotive 30-A isolated 5.7-kV VRMS IGBT/SiC MOSFET gate driver with advanced protection features 36-SSOP -40 to 125

## Sheet IsoSupply.SchDoc
size A4; DocumentNumber: 3; SheetNumber: 5; SheetTotal: 15
Used 6 times, as channels PBD/HBU/DRVH/ISU, PBD/HBU/DRVL/ISU, PBD/HBW/DRVH/ISU, PBD/HBW/DRVL/ISU, PBD/HBV/DRVH/ISU, PBD/HBV/DRVL/ISU. Parts and nets are listed once, with the designators drawn on the sheet.
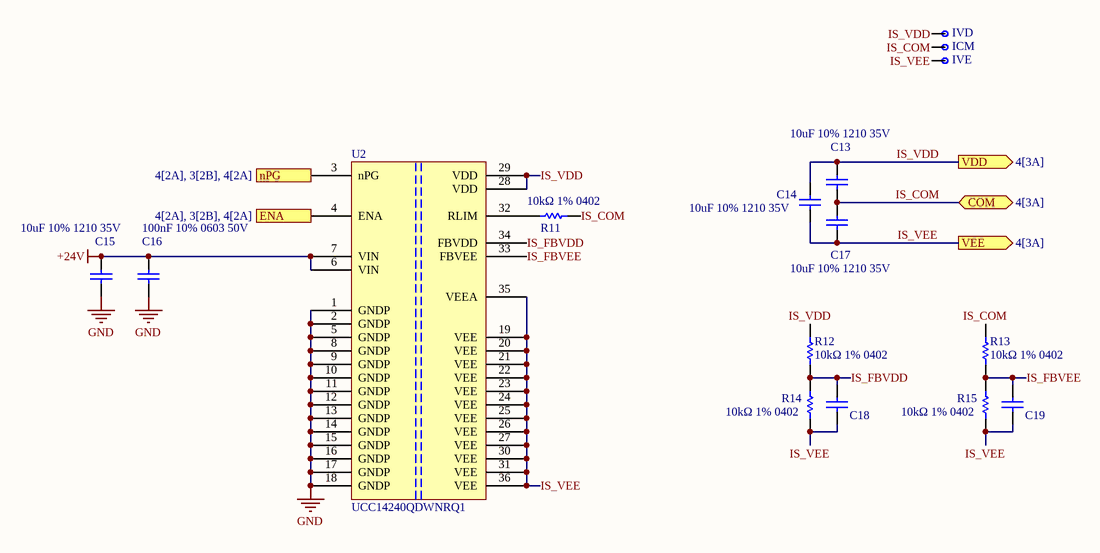
[diagram p5: IsoSupply.SchDoc]

### Parts
C13  10uF 10% 1210 35V  [1210N]
C14  10uF 10% 1210 35V  [1210N]
C15  10uF 10% 1210 35V  [1210N]
C16  100nF 10% 0603 50V  [0603N]
C17  10uF 10% 1210 35V  [1210N]
C18  100nF 10% 0402 25V  [0402N]  (value not drawn)
C19  100nF 10% 0402 25V  [0402N]  (value not drawn)
ICM  Testpoint  [Testpoint-Footprint-1]  (value not drawn)  (no BOM)
IVD  Testpoint  [Testpoint-Footprint-1]  (value not drawn)  (no BOM)
IVE  Testpoint  [Testpoint-Footprint-1]  (value not drawn)  (no BOM)
R11  10kΩ 1% 0402  [0402N]
R12  10kΩ 1% 0402  [0402N]
R13  10kΩ 1% 0402  [0402N]
R14  10kΩ 1% 0402  [0402N]
R15  10kΩ 1% 0402  [0402N]
U2  UCC14240QDWNRQ1  [UCC14240QDWNRQ1-Footprint-1]

### Ports
COM (bidir, see 4[3A]), ENA (in, see 4[2A], 3[2B], 4[2A]), nPG (out, see 4[2A], 3[2B], 4[2A]), VDD (out, see 4[3A]), VEE (out, see 4[3A])

### Nets
+24V: C15.2 C16.2 U2.6(VIN) U2.7(VIN)
GND: C15.1 C16.1 U2.1(GNDP) U2.2(GNDP) U2.5(GNDP) U2.8(GNDP) U2.9(GNDP) U2.10(GNDP) U2.11(GNDP) U2.12(GNDP) U2.13(GNDP) U2.14(GNDP) U2.15(GNDP) U2.16(GNDP) U2.17(GNDP) U2.18(GNDP)
ENA: U2.4(ENA) ; port ENA
IS_COM: C13.1 C17.2 ICM.1 R11.1 R13.1 ; port COM
IS_FBVDD: C18.1 R12.2 R14.2 U2.34(FBVDD)
IS_FBVEE: C19.1 R13.2 R15.2 U2.33(FBVEE)
IS_VDD: C13.2 C14.2 IVD.1 R12.1 U2.28(VDD) U2.29(VDD) ; port VDD
IS_VEE: C14.1 C17.1 C18.2 C19.2 IVE.1 R14.1 R15.1 U2.19(VEE) U2.20(VEE) U2.21(VEE) U2.22(VEE) U2.23(VEE) U2.24(VEE) U2.25(VEE) U2.26(VEE) U2.27(VEE) U2.30(VEE) U2.31(VEE) U2.35(VEEA) U2.36(VEE) ; port VEE
nPG: U2.3(nPG) ; port nPG
NetR11_2: R11.2 U2.32(RLIM)

### Channels
PBD/HBU/DRVH/ISU: designators end in _PBD_HBU_DRVH_ISU; ports COM=DRV_COM ENA=BRIDGE_ENA nPG=CTRL_nPG VDD=DRV_VDD_DRVH VEE=DRV_VEE_DRVH
PBD/HBU/DRVL/ISU: designators end in _PBD_HBU_DRVL_ISU; ports COM=DRV_COM ENA=BRIDGE_ENA nPG=CTRL_nPG VDD=DRV_VDD_DRVL VEE=DRV_VEE_DRVL
PBD/HBW/DRVH/ISU: designators end in _PBD_HBW_DRVH_ISU; ports COM=DRV_COM ENA=BRIDGE_ENA nPG=CTRL_nPG VDD=DRV_VDD_DRVH VEE=DRV_VEE_DRVH
PBD/HBW/DRVL/ISU: designators end in _PBD_HBW_DRVL_ISU; ports COM=DRV_COM ENA=BRIDGE_ENA nPG=CTRL_nPG VDD=DRV_VDD_DRVL VEE=DRV_VEE_DRVL
PBD/HBV/DRVH/ISU: designators end in _PBD_HBV_DRVH_ISU; ports COM=DRV_COM ENA=BRIDGE_ENA nPG=CTRL_nPG VDD=DRV_VDD_DRVH VEE=DRV_VEE_DRVH
PBD/HBV/DRVL/ISU: designators end in _PBD_HBV_DRVL_ISU; ports COM=DRV_COM ENA=BRIDGE_ENA nPG=CTRL_nPG VDD=DRV_VDD_DRVL VEE=DRV_VEE_DRVL

### Library data of the parts
C13-C15 C17 = C1210: Capacitance: 10u; Tolerance: 10; Voltage: 35; Footprint: 1210
C16 = C0603: as C7 on sheet Driver; Footprint: 0603
C18 C19 = C0402: as C1 on sheet Driver; Footprint: 0402
ICM IVD IVE = CMP-003-000002-1
R11-R15 = R0402: Resistance: 10k; Tolerance: 1; Footprint: 0402
U2 = CMP-019-00063-1: Automotive, 1.5-W, 24-Vin, regulated, 3-kVRMS isolated DC/DC module with integrated transformer</ 36-SO-MOD -40 to 125

## Sheet IoExpander.SchDoc
size A4; DocumentNumber: 6; SheetNumber: 6; SheetTotal: 15
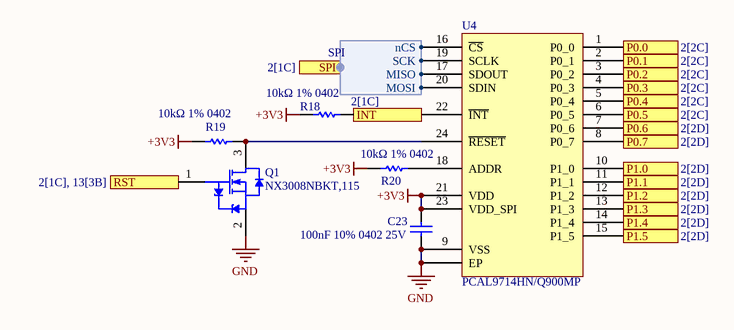
[diagram p6: IoExpander.SchDoc]

### Parts
C23  100nF 10% 0402 25V  [0402N]
Q1  NX3008NBKT,115  [NXP-SOT416_B_L]
R18  10kΩ 1% 0402  [0402N]
R19  10kΩ 1% 0402  [0402N]
R20  10kΩ 1% 0402  [0402N]
U4  PCAL9714HN/Q900MP  [PCAL9714HN_Q900MP-Footprint-1]

### Ports
INT (out, see 2[1C]), P0.0 (in, see 2[2C]), P0.1 (in, see 2[2C]), P0.2 (in, see 2[2C]), P0.3 (in, see 2[2C]), P0.4 (in, see 2[2C]), P0.5 (in, see 2[2C]), P0.6 (in, see 2[2D]), P0.7 (in, see 2[2D]), P1.0 (in, see 2[2D]), P1.1 (in, see 2[2D]), P1.2 (in, see 2[2D]), P1.3 (in, see 2[2D]), P1.4 (in, see 2[2D]), P1.5 (in, see 2[2D]), RST (in, see 2[1C], 13[3B]), SPI (harness SPI, see 2[1C])

### Harnesses
SPI: nCS, SCK, MISO, MOSI

### Nets
+3V3: C23.2 R18.2 R19.2 R20.2 U4.21(VDD) U4.23(VDD_SPI)
GND: C23.1 Q1.2(S) U4.9(VSS) U4.EP
U_nFLT1_H: U4.4(P0_3) ; port P0.3
U_nFLT1_L: U4.2(P0_1) ; port P0.1
U_nFLT2_H: U4.3(P0_2) ; port P0.2
U_nFLT2_L: U4.1(P0_0) ; port P0.0
V_nFLT1_H: U4.5(P0_4) ; port P0.4
V_nFLT1_L: U4.11(P1_1) ; port P1.1
V_nFLT2_H: U4.6(P0_5) ; port P0.5
V_nFLT2_L: U4.10(P1_0) ; port P1.0
W_nFLT1_H: U4.13(P1_3) ; port P1.3
W_nFLT1_L: U4.15(P1_5) ; port P1.5
W_nFLT2_H: U4.12(P1_2) ; port P1.2
W_nFLT2_L: U4.14(P1_4) ; port P1.4
NetP1_39: R18.1 U4.22(~{INT}) ; port INT
NetP1_41: Q1.1(G) ; port RST
NetQ1_3: Q1.3(D) R19.1 U4.24(~{RESET})
NetR20_1: R20.1 U4.18(ADDR)
NetU4_7: U4.7(P0_6) ; port P0.6
NetU4_8: U4.8(P0_7) ; port P0.7
NetU4_16: U4.16(~{CS}) ; port SPI.nCS
NetU4_17: U4.17(SDOUT) ; port SPI.MISO
NetU4_19: U4.19(SCLK) ; port SPI.SCK
NetU4_20: U4.20(SDIN) ; port SPI.MOSI

### Library data of the parts
C23 = C0402: as C1 on sheet Driver; Footprint: 0402
Q1 = CMP-1259-00268-1: N-Channel Trench MOSFET, 30 V, 0.35 A, -55 to 150 degC, 3-Pin SOT416, Tape and Reel; Manufacturer: NXP Semiconductors; Automotive Qualified: Y; ID [max] (A): 0.35; IDM [max] (A): 1.4; VDS [max] (V): 30; Channel Type: N; VGSth [typ] (V): 0.9; Packing: Tape & Reel; DatasheetVersion: Rev. 1; PackageVersion: 06-03-16, 03/2006; ComponentLink2Description: Datasheet; PartNumber: NX3008NBKT,115; ComponentLink3URL: http://www.nxp.com/documents/data_sheet/2N7002PT.pdf; ComponentLink2URL: http://www.nxp.com/documents/data_sheet/NX3008NBKT.pdf; Code_JEITA: SC-75; PackageReference: SOT416_B; ComponentLink3Description: Package Specification; PackageDescription: 3-Pin Small Outline Transistor Package, Body 1.6 x 0.8 mm, Pitch 0.5 mm; Mounting Technology: Surface Mount; ComponentLink1URL: http://www.nxp.com/; ComponentLink1Description: Manufacturer URL
R18-R20 = R0402: Resistance: 10k; Tolerance: 1; Footprint: 0402
U4 = CMP-015-00014-1: Low-voltage Translating 14-BIT Spi I/o Expander - AEC_Q100 Compliant

## Sheet SpiMux.SchDoc
size A4; DocumentNumber: 7; SheetNumber: 7; SheetTotal: 15
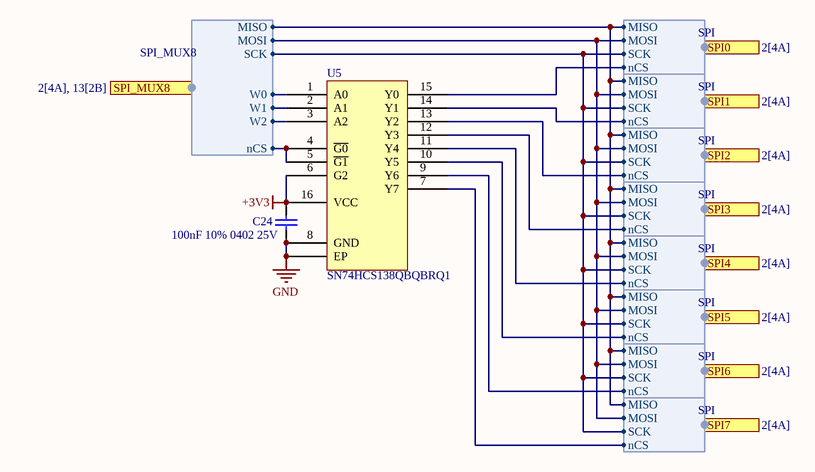
[diagram p7: SpiMux.SchDoc]

### Parts
C24  100nF 10% 0402 25V  [0402N]
U5  SN74HCS138QBQBRQ1  [SN74HCS138QBQBRQ1-Footprint-1]

### Ports
SPI0 (harness SPI, see 2[4A]), SPI1 (harness SPI, see 2[4A]), SPI2 (harness SPI, see 2[4A]), SPI3 (harness SPI, see 2[4A]), SPI4 (harness SPI, see 2[4A]), SPI5 (harness SPI, see 2[4A]), SPI6 (harness SPI, see 2[4A]), SPI7 (harness SPI, see 2[4A]), SPI_MUX8 (harness SPI_MUX8, see 2[4A], 13[2B])

### Harnesses
SPI_MUX8: nCS, SCK, MISO, MOSI, W0, W1, W2
SPI: nCS, SCK, MISO, MOSI

### Nets
+3V3: C24.2 U5.6(G2) U5.16(VCC)
GND: C24.1 U5.8(GND) U5.17(EP)
NetP1_17: port SPI_MUX8.MISO, port SPI0.MISO, port SPI1.MISO, port SPI2.MISO, port SPI3.MISO, port SPI4.MISO, port SPI5.MISO, port SPI6.MISO, port SPI7.MISO
NetP1_18: port SPI_MUX8.MOSI, port SPI0.MOSI, port SPI1.MOSI, port SPI2.MOSI, port SPI3.MOSI, port SPI4.MOSI, port SPI5.MOSI, port SPI6.MOSI, port SPI7.MOSI
NetP1_19: port SPI_MUX8.SCK, port SPI0.SCK, port SPI1.SCK, port SPI2.SCK, port SPI3.SCK, port SPI4.SCK, port SPI5.SCK, port SPI6.SCK, port SPI7.SCK
NetP1_20: U5.4(~{G0}) U5.5(~{G1}) ; port SPI_MUX8.nCS
NetP1_21: U5.1(A0) ; port SPI_MUX8.W0
NetP1_22: U5.2(A1) ; port SPI_MUX8.W1
NetP1_23: U5.3(A2) ; port SPI_MUX8.W2
NetU5_7: U5.7(Y7) ; port SPI7.nCS
NetU5_9: U5.9(Y6) ; port SPI6.nCS
NetU5_10: U5.10(Y5) ; port SPI5.nCS
NetU5_11: U5.11(Y4) ; port SPI4.nCS
NetU5_12: U5.12(Y3) ; port SPI3.nCS
NetU5_13: U5.13(Y2) ; port SPI2.nCS
NetU5_14: U5.14(Y1) ; port SPI1.nCS
NetU5_15: U5.15(Y0) ; port SPI0.nCS

### Library data of the parts
C24 = C0402: as C1 on sheet Driver; Footprint: 0402
U5 = CMP-016-00012-1: Automotive 3-line to 8-line decoders/demultiplexer 16-WQFN -40 to 125

## Sheet TempAdc.SchDoc
size A4; DocumentNumber: 8; SheetNumber: 8; SheetTotal: 15
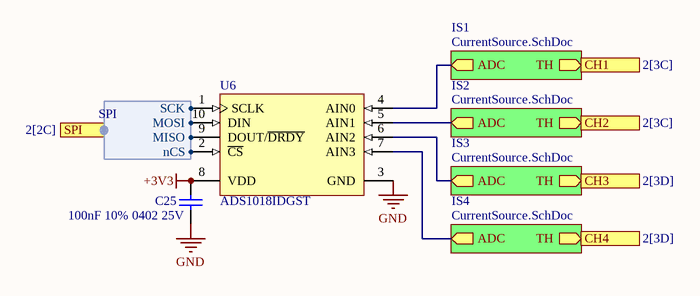
[diagram p8: TempAdc.SchDoc]

### Parts
C25  100nF 10% 0402 25V  [0402N]
U6  ADS1018IDGST  [TI-DGS10_N]

### Sub-sheets
IS1 = CurrentSource.SchDoc: TH (out), ADC (out)
IS2 = CurrentSource.SchDoc: TH (out), ADC (out)
IS3 = CurrentSource.SchDoc: TH (out), ADC (out)
IS4 = CurrentSource.SchDoc: TH (out), ADC (out)

### Ports
CH1 (out, see 2[3C]), CH2 (out, see 2[3C]), CH3 (out, see 2[3D]), CH4 (out, see 2[3D]), SPI (out, harness SPI, see 2[2C])

### Harnesses
SPI: nCS, SCK, MISO, MOSI

### Nets
+3V3: C25.2 U6.8(VDD)
GND: C25.1 U6.3(GND)
NetC22_IS1_2: U6.4(AIN0) ; sheet IS1/ADC
NetC22_IS2_2: U6.5(AIN1) ; sheet IS2/ADC
NetC22_IS3_2: U6.6(AIN2) ; sheet IS3/ADC
NetC22_IS4_2: U6.7(AIN3) ; sheet IS4/ADC
NetR2_1: port CH4, sheet IS4/TH
NetR16_IS1_2: port CH1, sheet IS1/TH
NetR16_IS2_2: port CH2, sheet IS2/TH
NetR16_IS3_2: port CH3, sheet IS3/TH
NetU6_1: U6.1(SCLK) ; port SPI.SCK
NetU6_2: U6.2(~{CS}) ; port SPI.nCS
NetU6_9: U6.9(DOUT/~{DRDY}) ; port SPI.MISO
NetU6_10: U6.10(DIN) ; port SPI.MOSI

### Library data of the parts
C25 = C0402: as C1 on sheet Driver; Footprint: 0402
U6 = CMP-0003-00370-2: 12-Bit ADC with Integrated MUX, PGA, Temperature Sensor, Oscillator and Reference, -40 to 125 degC, 10-pin SOP (DGS10), Green (RoHS & no Sb/Br); Manufacturer: Texas Instruments; SubFamily: Precision ADC (<=10MSPS); Digital Supply(Min)(V): 2; INL(Max)(+/-LSB): 0.5; Digital Supply(Max)(V): 5.5; # Input Channels: 4; Architecture: Delta-Sigma; Sample Rate(max)(SPS): 3.3k; Resolution(Bits): 12; Interface: Serial SPI; ComponentLink2URL: http://www.ti.com/lit/ds/symlink/ads1018.pdf; DatasheetVersion: SBAS526A; PackageVersion: 4073272/C, 02/2004; Mounting Technology: Surface Mount; ComponentLink2Description: Datasheet; Eco-Plan: Green (RoHS & no Sb/Br); ComponentLink1Description: Manufacturer URL; PackageReference: DGS10; Code_JEDEC: MO-153; ComponentLink1URL: http://www.ti.com/; Analog Voltage AV/DD(Min)(V): 2; Analog Voltage AV/DD(Max)(V): 5.5; ComponentLink3Description: Package Specification; ComponentLink3URL: http://www.ti.com/lit/ml/mpds035b/mpds035b.pdf; PartNumber: ADS1018IDGST; PackageDescription: 10-Pin Plastic Small Outline, Body 3 x 3 mm, Pitch 0.5 mm

## Sheet CurrentSource.SchDoc
size A4; DocumentNumber: 4; SheetNumber: 9; SheetTotal: 15
Used 4 times, as channels PBD/TAD/IS1, PBD/TAD/IS2, PBD/TAD/IS3, PBD/TAD/IS4. Parts and nets are listed once, with the designators drawn on the sheet.
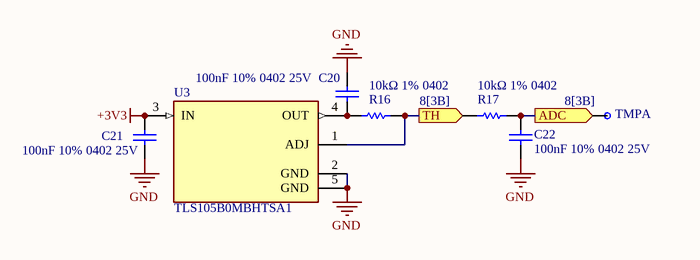
[diagram p9: CurrentSource.SchDoc]

### Parts
C20  100nF 10% 0402 25V  [0402N]
C21  100nF 10% 0402 25V  [0402N]
C22  100nF 10% 0402 25V  [0402N]
R16  10kΩ 1% 0402  [0402N]
R17  10kΩ 1% 0402  [0402N]
TMPA  Testpoint  [Testpoint-Footprint-1]  (value not drawn)  (no BOM)
U3  TLS105B0MBHTSA1  [FP-PG-SCT595-5-MFG]

### Ports
ADC (out, see 8[3B]), TH (out, see 8[3B])

### Nets
+3V3: C21.2 U3.3(IN)
GND: C20.1 C21.1 C22.1 U3.2(GND) U3.5(GND)
ADC: C22.2 R17.2 TMPA.1 ; port ADC
TH: R16.2 R17.1 U3.1(ADJ) ; port TH
NetC20_2: C20.2 R16.1 U3.4(OUT)

### Channels
PBD/TAD/IS1: designators end in _IS1; ports ADC=NetC22_IS1_2 TH=NetR16_IS1_2
PBD/TAD/IS2: designators end in _IS2; ports ADC=NetC22_IS2_2 TH=NetR16_IS2_2
PBD/TAD/IS3: designators end in _IS3; ports ADC=NetC22_IS3_2 TH=NetR16_IS3_2
PBD/TAD/IS4: designators end in _IS4; ports ADC=NetC22_IS4_2 TH=NetR2_1

### Library data of the parts
C20-C22 = C0402: as C1 on sheet Driver; Footprint: 0402
R16 R17 = R0402: Resistance: 10k; Tolerance: 1; Footprint: 0402
TMPA = CMP-003-000002-1
U3 = CMP-32856-000017-1: IC REG LIN POS ADJ 120MA SCT595; Accuracy: 0.1%; Watchdog Timer: No; Max Output Voltage: 20V; Output Configuration: Positive; Max Input Voltage: 40V; Max Supply Current: 5.5mA; Min Output Voltage: 2V; Number of Regulators: 1; Output Type: Adjustable; Power Supply Rejection Ratio (PSRR): 100dB; Output Current: 50mA; Quiescent Current: 40A; Dropout Voltage: 250mV; Mount: Surface Mount; Halogen Free: Not Halogen Free; Case/Package: SMD/SMT; Max Supply Voltage: 40V; Series: Automotive, AEC-Q100; Packaging: Cut Tape; Min Operating Temperature: -40°C; Max Operating Temperature: 150°C; Lead Free: Lead Free

## Sheet DcLink.SchDoc
size A4; DocumentNumber: 9; SheetNumber: 10; SheetTotal: 15
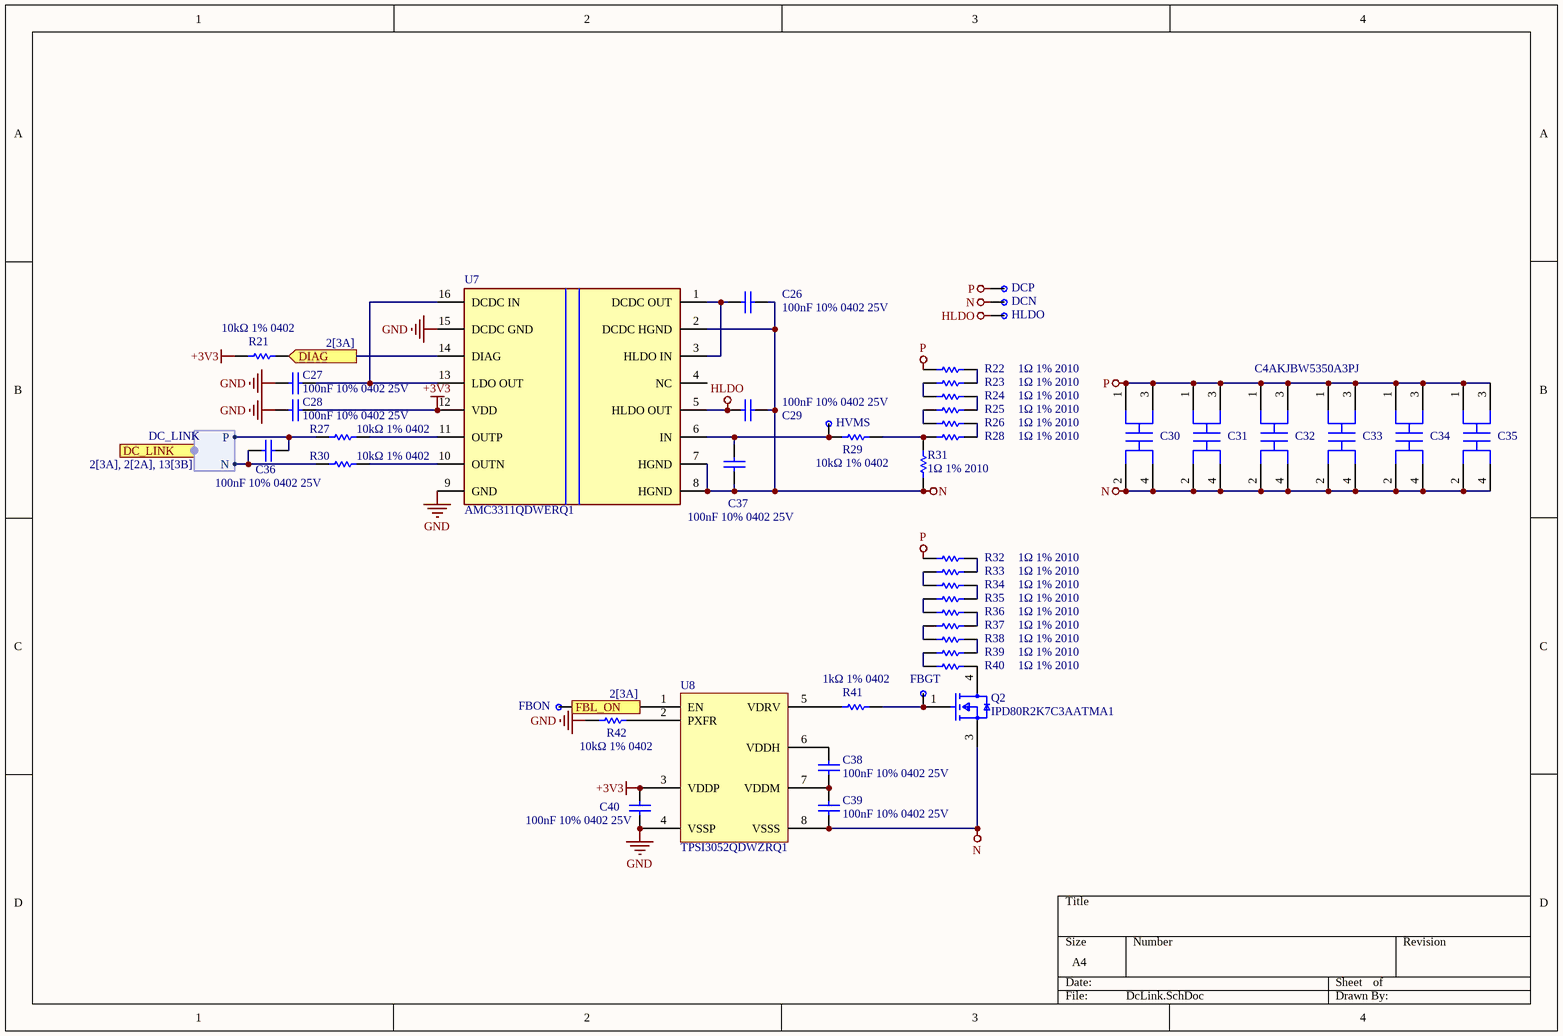
[diagram p10: DcLink.SchDoc]

### Parts
C26  100nF 10% 0402 25V  [0402N]
C27  100nF 10% 0402 25V  [0402N]
C28  100nF 10% 0402 25V  [0402N]
C29  100nF 10% 0402 25V  [0402N]
C30  C4AKJBW5350A3PJ  [FP-C4BWP-MFG]
C31  C4AKJBW5350A3PJ  [FP-C4BWP-MFG]  (value not drawn)
C32  C4AKJBW5350A3PJ  [FP-C4BWP-MFG]  (value not drawn)
C33  C4AKJBW5350A3PJ  [FP-C4BWP-MFG]  (value not drawn)
C34  C4AKJBW5350A3PJ  [FP-C4BWP-MFG]  (value not drawn)
C35  C4AKJBW5350A3PJ  [FP-C4BWP-MFG]  (value not drawn)
C36  100nF 10% 0402 25V  [0402N]
C37  100nF 10% 0402 25V  [0402N]
C38  100nF 10% 0402 25V  [0402N]
C39  100nF 10% 0402 25V  [0402N]
C40  100nF 10% 0402 25V  [0402N]
DCN  Testpoint  [Testpoint-Footprint-1]  (value not drawn)  (no BOM)
DCP  Testpoint  [Testpoint-Footprint-1]  (value not drawn)  (no BOM)
FBGT  Testpoint  [Testpoint-Footprint-1]  (value not drawn)  (no BOM)
FBON  Testpoint  [Testpoint-Footprint-1]  (value not drawn)  (no BOM)
HLDO  Testpoint  [Testpoint-Footprint-1]  (value not drawn)  (no BOM)
HVMS  Testpoint  [Testpoint-Footprint-1]  (value not drawn)  (no BOM)
Q2  IPD80R2K7C3AATMA1  [FP-PG-TO252-3-MFG]
R21  10kΩ 1% 0402  [0402N]
R22  1Ω 1% 2010  [2010N]
R23  1Ω 1% 2010  [2010N]
R24  1Ω 1% 2010  [2010N]
R25  1Ω 1% 2010  [2010N]
R26  1Ω 1% 2010  [2010N]
R27  10kΩ 1% 0402  [0402N]
R28  1Ω 1% 2010  [2010N]
R29  10kΩ 1% 0402  [0402N]
R30  10kΩ 1% 0402  [0402N]
R31  1Ω 1% 2010  [2010N]
R32  1Ω 1% 2010  [2010N]
R33  1Ω 1% 2010  [2010N]
R34  1Ω 1% 2010  [2010N]
R35  1Ω 1% 2010  [2010N]
R36  1Ω 1% 2010  [2010N]
R37  1Ω 1% 2010  [2010N]
R38  1Ω 1% 2010  [2010N]
R39  1Ω 1% 2010  [2010N]
R40  1Ω 1% 2010  [2010N]
R41  1kΩ 1% 0402  [0402N]
R42  10kΩ 1% 0402  [0402N]
U7  AMC3311QDWERQ1  [FP-DWE0016A-MFG]
U8  TPSI3052QDWZRQ1  [TPSI3052QDWZRQ1-Footprint-1]

### Ports
DC_LINK (out, harness DC_LINK, see 2[3A], 2[2A], 13[3B]), DIAG (out, see 2[3A]), FBL_ON (in, see 2[3A])

### Harnesses
DC_LINK: P, N

### Nets
+3V3: C28.1 C40.2 R21.2 U7.12(VDD) U8.3(VDDP)
GND: C27.2 C28.2 C40.1 R42.1 U7.9(GND) U7.15(DCDC_GND) U8.4(VSSP)
HLDO: C29.2 HLDO.1 U7.5(HLDO_OUT)
N: C26.1 C29.1 C30.2 C30.4 C31.2 C31.4 C32.2 C32.4 C33.2 C33.4 C34.2 C34.4 C35.2 C35.4 C37.1 C39.2 DCN.1 Q2.3(source) R31.1 U7.2(DCDC_HGND) U7.7(HGND) U7.8(HGND) U8.8(VSSS)
P: C30.1 C30.3 C31.1 C31.3 C32.1 C32.3 C33.1 C33.3 C34.1 C34.3 C35.1 C35.3 DCP.1 R22.2 R32.2
NetC26_2: C26.2 U7.1(DCDC_OUT) U7.3(HLDO_IN)
NetC27_1: C27.1 U7.13(LDO_OUT) U7.16(DCDC_IN)
NetC36_1: C36.1 R27.1 ; port DC_LINK.P
NetC36_2: C36.2 R30.1 ; port DC_LINK.N
NetC37_2: C37.2 HVMS.1 R29.1 U7.6(IN)
NetC38_1: C38.1 U8.6(VDDH)
NetC38_2: C38.2 C39.1 U8.7(VDDM)
NetFBGT_1: FBGT.1 Q2.1(gate) R41.1
NetFBON_1: FBON.1 U8.1(EN) ; port FBL_ON
NetP1_42: R21.1 U7.14(DIAG) ; port DIAG
NetQ2_4: Q2.4(drain) R40.1
NetR22_1: R22.1 R23.1
NetR23_2: R23.2 R24.2
NetR24_1: R24.1 R25.1
NetR25_2: R25.2 R26.2
NetR26_1: R26.1 R28.1
NetR27_2: R27.2 U7.11(OUTP)
NetR28_2: R28.2 R29.2 R31.2
NetR30_2: R30.2 U7.10(OUTN)
NetR32_1: R32.1 R33.1
NetR33_2: R33.2 R34.2
NetR34_1: R34.1 R35.1
NetR35_2: R35.2 R36.2
NetR36_1: R36.1 R37.1
NetR37_2: R37.2 R38.2
NetR38_1: R38.1 R39.1
NetR39_2: R39.2 R40.2
NetR41_2: R41.2 U8.5(VDRV)
NetR42_2: R42.2 U8.2(PXFR)

Not connected (* = marked no-connect by the designer): U7 4(NC)

### Library data of the parts
C26-C29 C36-C40 = C0402: as C1 on sheet Driver; Footprint: 0402
C30-C35 = CMP-03022-000060-1: FILM, RADIAL, METALLIZED POLYPRO
DCN DCP FBGT FBON HLDO HVMS = CMP-003-000002-1
Q2 = CMP-32901-001052-1: MOSFET N-CH TO252-3; Drain to Source Voltage (Vdss): 800V; RoHS Compliant: Yes; Lead Free: Contains Lead; Halogen Free: Halogen Free; Series: *; Mount: Surface Mount; Max Dual Supply Voltage: 800V
R21 R27 R29 R30 R42 = R0402: Resistance: 10k; Tolerance: 1; Footprint: 0402
R22-R26 R28 R31-R40 = R2010: Resistance: 1; Tolerance: 1; Footprint: 2010
R41 = R0402: Resistance: 1k; Tolerance: 1; Footprint: 0402
U7 = CMP-00370-143191617-1: AMC3311QDWERQ1 Automotive, 0 to 2-V input, precision reinforced isolated amplifier with integrated DC/DC converter 16-SOIC -40 to 125; Manufacturer Lifecycle Status: ACTIVE; Response Time: 600µs; Bandwidth: 275kHz; Max Junction Temperature (Tj): 150°C; Number of Channels: 1; Input Offset Voltage (Vos): 100µV; Min Supply Voltage: 3V; Max Supply Voltage: 5.5V; Output Current per Channel: 14mA; Input Bias Current: 3.5nA; NexarPartId: 143191617; Width: 7.5mm; Length: 10.3mm; Number of Pins: 16; Max Operating Temperature: 125°C; Ambient Temperature Range High: 125°C; Height: 2.65mm; Thickness: 2.35mm; Min Operating Temperature: -40°C; Lifecycle Status: Production
U8 = CMP-00024-00007-1: Automotive reinforced isolated switch driver with integrated 15-V gate supply 8-SO-MOD -40 to 125

## Sheet AndGate.SchDoc
size A4; DocumentNumber: 13; SheetNumber: 11; SheetTotal: 15
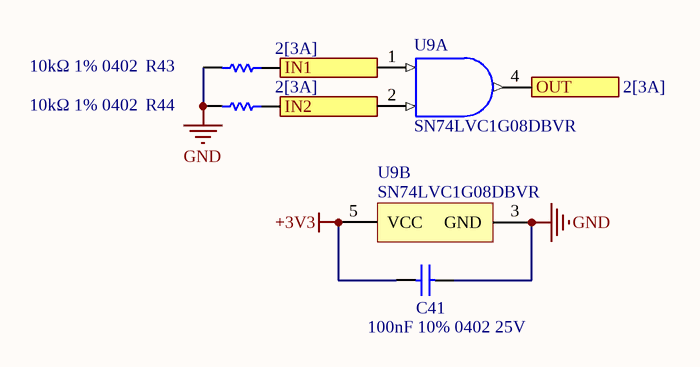
[diagram p11: AndGate.SchDoc]

### Parts
C41  100nF 10% 0402 25V  [0402N]
R43  10kΩ 1% 0402  [0402N]
R44  10kΩ 1% 0402  [0402N]
U9  SN74LVC1G08DBVR  [DBV0005A_M]  (parts A,B of 2)

### Ports
IN1 (in, see 2[3A]), IN2 (in, see 2[3A]), OUT (out, see 2[3A])

### Nets
+3V3: C41.1 U9.5(VCC)
GND: C41.2 R43.2 R44.2 U9.3(GND)
BRIDGE_ENA: U9.4(Y) ; port OUT
CTRL_ENA: R43.1 U9.1(A) ; port IN1
NetP1_40: R44.1 U9.2(B) ; port IN2

### Library data of the parts
C41 = C0402: as C1 on sheet Driver; Footprint: 0402
R43 R44 = R0402: Resistance: 10k; Tolerance: 1; Footprint: 0402
U9 = CMP-0859-00053-3: Single 2-Input Positive-AND Gate, DBV0005A, LARGE T&R; Manufacturer: Texas Instruments; Logic: True; ICC @ Nom Voltage(Max)(mA): 0.01; VCC(Min)(V): 1.65; Bits(#): 1; Rating: Catalog; Schmitt Trigger: No; Voltage(Nom)(V): 1.8,2.5,3.3,5; Output Drive (IOL/IOH)(Max)(mA): 32/-32; Gate Type: AND; tpd @ Nom Voltage(Max)(ns): 4.5,6,4,5; VCC(Max)(V): 5.5; Output Type: CMOS; F @ Nom Voltage(Max)(Mhz): 150; Input Type: CMOS/TTL; Technology Family: LVC; Sub-Family: AND Gate; PackageReference: DBV0005A; Generic Part Number: SN74LVC1G08; Operating Temperature Range(C): -40 to 125,-40 to 85; 3-State Output: No; DatasheetVersion: SCES217Y

## Sheet Rectifier.SchDoc
size A4; DocumentNumber: 14; SheetNumber: 12; SheetTotal: 14
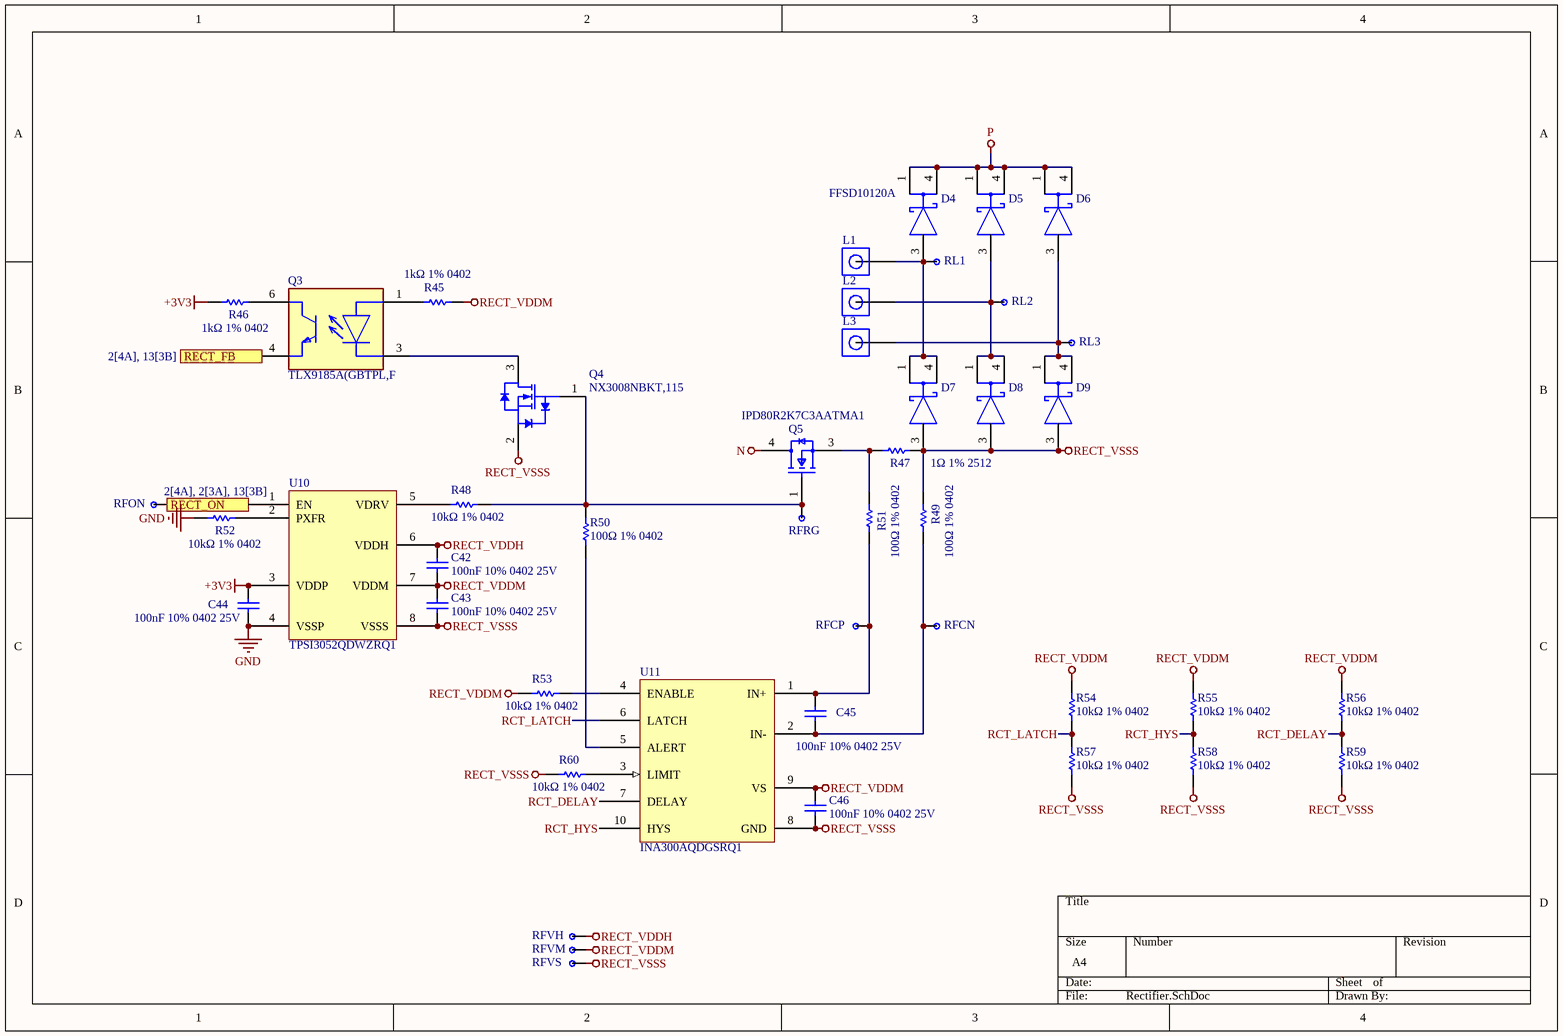
[diagram p12: Rectifier.SchDoc]

### Parts
C42  100nF 10% 0402 25V  [0402N]
C43  100nF 10% 0402 25V  [0402N]
C44  100nF 10% 0402 25V  [0402N]
C45  100nF 10% 0402 25V  [0402N]
C46  100nF 10% 0402 25V  [0402N]
D4  FFSD10120A  [FP-369AS-MFG]
D5  FFSD10120A  [FP-369AS-MFG]  (value not drawn)
D6  FFSD10120A  [FP-369AS-MFG]  (value not drawn)
D7  FFSD10120A  [FP-369AS-MFG]  (value not drawn)
D8  FFSD10120A  [FP-369AS-MFG]  (value not drawn)
D9  FFSD10120A  [FP-369AS-MFG]  (value not drawn)
L1  Pad  [Pad-Footprint-2]  (value not drawn)  (no BOM)
L2  Pad  [Pad-Footprint-2]  (value not drawn)  (no BOM)
L3  Pad  [Pad-Footprint-2]  (value not drawn)  (no BOM)
Q3  TLX9185A(GBTPL,F  [FP-11-4M1S-MFG]
Q4  NX3008NBKT,115  [NXP-SOT416_B_L]
Q5  IPD80R2K7C3AATMA1  [FP-PG-TO252-3-MFG]
R45  1kΩ 1% 0402  [0402N]
R46  1kΩ 1% 0402  [0402N]
R47  1Ω 1% 2512  [2512L]
R48  10kΩ 1% 0402  [0402N]
R49  100Ω 1% 0402  [0402N]
R50  100Ω 1% 0402  [0402N]
R51  100Ω 1% 0402  [0402N]
R52  10kΩ 1% 0402  [0402N]
R53  10kΩ 1% 0402  [0402N]
R54  10kΩ 1% 0402  [0402N]
R55  10kΩ 1% 0402  [0402N]
R56  10kΩ 1% 0402  [0402N]
R57  10kΩ 1% 0402  [0402N]
R58  10kΩ 1% 0402  [0402N]
R59  10kΩ 1% 0402  [0402N]
R60  10kΩ 1% 0402  [0402N]
RFCN  Testpoint  [Testpoint-Footprint-1]  (value not drawn)  (no BOM)
RFCP  Testpoint  [Testpoint-Footprint-1]  (value not drawn)  (no BOM)
RFON  Testpoint  [Testpoint-Footprint-1]  (value not drawn)  (no BOM)
RFRG  Testpoint  [Testpoint-Footprint-1]  (value not drawn)  (no BOM)
RFVH  Testpoint  [Testpoint-Footprint-1]  (value not drawn)  (no BOM)
RFVM  Testpoint  [Testpoint-Footprint-1]  (value not drawn)  (no BOM)
RFVS  Testpoint  [Testpoint-Footprint-1]  (value not drawn)  (no BOM)
RL1  Testpoint  [Testpoint-Footprint-1]  (value not drawn)  (no BOM)
RL2  Testpoint  [Testpoint-Footprint-1]  (value not drawn)  (no BOM)
RL3  Testpoint  [Testpoint-Footprint-1]  (value not drawn)  (no BOM)
U10  TPSI3052QDWZRQ1  [TPSI3052QDWZRQ1-Footprint-1]
U11  INA300AQDGSRQ1  [INA300AQDGSRQ1-Footprint-2]

### Ports
RECT_FB (out, see 2[4A], 13[3B]), RECT_ON (in, see 2[4A], 2[3A], 13[3B])

### Nets
+3V3: C44.2 R46.1 U10.3(VDDP)
GND: C44.1 R52.1 U10.4(VSSP)
N: Q5.4(drain)
P: D4.1(C) D4.4(C) D5.1(C) D5.4(C) D6.1(C) D6.4(C)
RECT_VDDH: C42.1 RFVH.1 U10.6(VDDH)
RECT_VDDM: C42.2 C43.1 C46.1 R45.1 R53.1 R54.2 R55.2 R56.2 RFVM.1 U10.7(VDDM) U11.9(VS)
RECT_VSSS: C43.2 C46.2 D7.3(A) D8.3(A) D9.3(A) Q4.2(S) R47.2 R49.2 R57.1 R58.1 R59.1 R60.2 RFVS.1 U10.8(VSSS) U11.8(GND)
RCT_DELAY: R56.1 R59.2 U11.7(DELAY)
RCT_HYS: R55.1 R58.2 U11.10(HYS)
RCT_LATCH: R54.1 R57.2 U11.6(LATCH)
NetC45_1: C45.1 R49.1 RFCN.1 U11.2(IN-)
NetC45_2: C45.2 R51.1 RFCP.1 U11.1(IN+)
NetD4_3: D4.3(A) D7.1(C) D7.4(C) L1.1 RL1.1
NetD5_3: D5.3(A) D8.1(C) D8.4(C) L2.1 RL2.1
NetD6_3: D6.3(A) D9.1(C) D9.4(C) L3.1 RL3.1
NetP1_52: RFON.1 U10.1(EN) ; port RECT_ON
NetP1_53: Q3.4(E) ; port RECT_FB
NetQ3_1: Q3.1(A) R45.2
NetQ3_3: Q3.3(C) Q4.3(D)
NetQ3_6: Q3.6(C) R46.2
NetQ4_1: Q4.1(G) Q5.1(gate) R48.1 R50.2 RFRG.1
NetQ5_3: Q5.3(source) R47.1 R51.2
NetR48_2: R48.2 U10.5(VDRV)
NetR50_1: R50.1 U11.5(ALERT)
NetR52_2: R52.2 U10.2(PXFR)
NetR53_2: R53.2 U11.4(ENABLE)
NetR60_1: R60.1 U11.3(LIMIT)

### Library data of the parts
C42-C46 = C0402: as C1 on sheet Driver; Footprint: 0402
D4-D9 = CMP-00278-84326837-1: FFSD10120A Rectifier Diode Schottky SiC 1.2KV 22A 3-Pin(2+Tab) DPAK T/R; Manufacturer Lifecycle Status: ACTIVE; Peak Reverse Current: 200µA; Capacitance: 612pF; Max Junction Temperature (Tj): 175°C; Element Configuration: Single; Max Forward Surge Current (Ifsm): 90A; Min Operating Temperature: -55°C; Max Repetitive Reverse Voltage (Vrrm): 1.2kV; Forward Current: 22A; Max Operating Temperature: 175°C; Weight: 260.37mg; Lifecycle Status: Production; RoHS: Compliant; Height: 2.517mm; NexarPartId: 84326837; Mount: Surface Mount
L1-L3 = CMP-003-000003-3: Single Pad
Q3 = CMP-35887-000017-1: TR COUPLER; 4-PIN SO6; AECQ; ROH
Q4 = CMP-1259-00268-1: as Q1 on sheet IoExpander; DatasheetVersion: Rev. 1; PackageVersion: 06-03-16, 03/2006; ComponentLink2Description: Datasheet; PartNumber: NX3008NBKT,115; ComponentLink3URL: http://www.nxp.com/documents/data_sheet/2N7002PT.pdf; ComponentLink2URL: http://www.nxp.com/documents/data_sheet/NX3008NBKT.pdf; Code_JEITA: SC-75; PackageReference: SOT416_B; ComponentLink3Description: Package Specification; PackageDescription: 3-Pin Small Outline Transistor Package, Body 1.6 x 0.8 mm, Pitch 0.5 mm; Mounting Technology: Surface Mount; ComponentLink1URL: http://www.nxp.com/; ComponentLink1Description: Manufacturer URL
Q5 = CMP-32901-001052-1: as Q2 on sheet DcLink; RoHS Compliant: Yes; Lead Free: Contains Lead; Halogen Free: Halogen Free; Series: *; Mount: Surface Mount; Max Dual Supply Voltage: 800V
R45 R46 = R0402: Resistance: 1k; Tolerance: 1; Footprint: 0402
R47 = R2512: Resistance: 1; Tolerance: 1; Footprint: 2512
R48 R52-R60 = R0402: Resistance: 10k; Tolerance: 1; Footprint: 0402
R49-R51 = R0402: Resistance: 100; Tolerance: 1; Footprint: 0402
RFCN RFCP RFON RFRG RFVH RFVM RFVS RL1-RL3 = CMP-003-000002-1
U10 = CMP-00024-00007-1: as U8 on sheet DcLink
U11 = CMP-014-00003-1: Comparator, 1 Func, -650uV Offset-Max, 100000ns Response Time, PDSO10; RoHS Compliant: Yes

## Sheet CurrentSense.SchDoc
size A4; DocumentNumber: 12; SheetNumber: 14; SheetTotal: 15
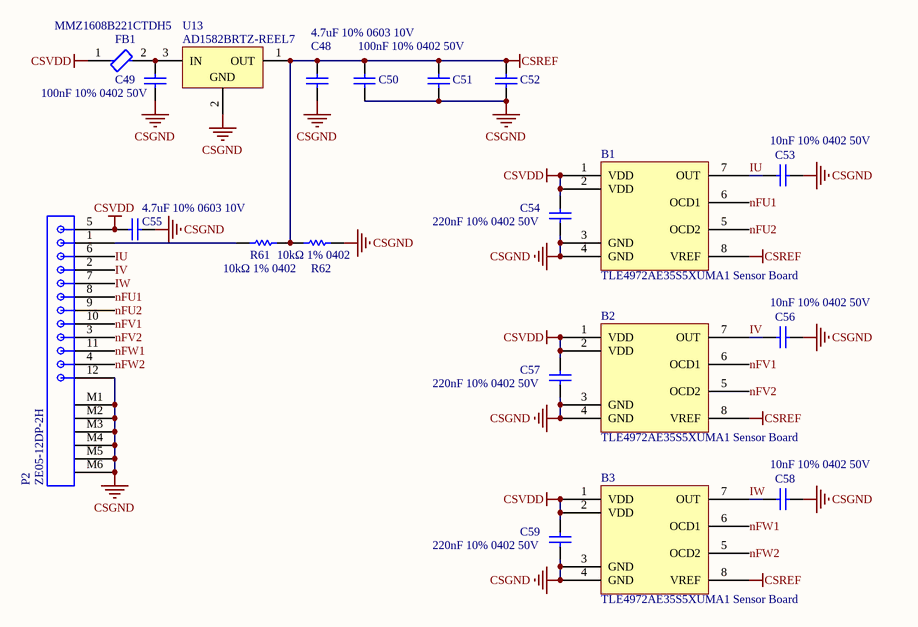
[diagram p13: CurrentSense.SchDoc]

### Parts
B1  TLE4972AE35S5XUMA1 Sensor Board  [TLE4972AE35S5XUMA1 Sensor Board-Footprint-1]
B2  TLE4972AE35S5XUMA1 Sensor Board  [TLE4972AE35S5XUMA1 Sensor Board-Footprint-1]
B3  TLE4972AE35S5XUMA1 Sensor Board  [TLE4972AE35S5XUMA1 Sensor Board-Footprint-1]
C48  4.7uF 10% 0603 10V  [0603L]
C49  100nF 10% 0402 50V  [0402N]
C50  100nF 10% 0402 50V  [0402N]
C51  100nF 10% 0402 50V  [0402N]  (value not drawn)
C52  100nF 10% 0402 50V  [0402N]  (value not drawn)
C53  10nF 10% 0402 50V  [0402N]
C54  220nF 10% 0402 50V  [0402N]
C55  4.7uF 10% 0603 10V  [0603L]
C56  10nF 10% 0402 50V  [0402N]
C57  220nF 10% 0402 50V  [0402N]
C58  10nF 10% 0402 50V  [0402N]
C59  220nF 10% 0402 50V  [0402N]
FB1  MMZ1608B221CTDH5  [FP-MMZ1608-0_6-MFG]
P2  ZE05-12DP-2H  [ZE05-12DP-2H-Footprint-1]
R61  10kΩ 1% 0402  [0402N]
R62  10kΩ 1% 0402  [0402N]
U13  AD1582BRTZ-REEL7  [ADI-RT-3_M]

### Nets
CSGND: B1.3(GND) B1.4(GND) B2.3(GND) B2.4(GND) B3.3(GND) B3.4(GND) C48.1 C49.1 C50.1 C51.1 C52.1 C53.1 C54.1 C55.1 C56.1 C57.1 C58.1 C59.1 P2.12 P2.M1 P2.M2 P2.M3 P2.M4 P2.M5 P2.M6 R62.2 U13.2(GND)
CSREF: B1.8(VREF) B2.8(VREF) B3.8(VREF) C48.2 C50.2 C51.2 C52.2 R61.2 R62.1 U13.1(OUT)
CSVDD: B1.1(VDD) B1.2(VDD) B2.1(VDD) B2.2(VDD) B3.1(VDD) B3.2(VDD) C54.2 C55.2 C57.2 C59.2 FB1.1 P2.5
IU: B1.7(OUT) C53.2 P2.6
IV: B2.7(OUT) C56.2 P2.2
IW: B3.7(OUT) C58.2 P2.7
nFU1: B1.6(OCD1) P2.8
nFU2: B1.5(OCD2) P2.9
nFV1: B2.6(OCD1) P2.10
nFV2: B2.5(OCD2) P2.3
nFW1: B3.6(OCD1) P2.11
nFW2: B3.5(OCD2) P2.4
NetC49_2: C49.2 FB1.2 U13.3(IN)
NetP2_1: P2.1 R61.1

### Library data of the parts
B1-B3 = CMP-010-00024-1
C48 C55 = C0603: Capacitance: 4.7u; Tolerance: 10; Voltage: 10; Footprint: 0603
C49-C52 = C0402: Capacitance: 100n; Tolerance: 10; Voltage: 50; Footprint: 0402
C53 C56 C58 = C0402: Capacitance: 10n; Tolerance: 10; Voltage: 50; Footprint: 0402
C54 C57 C59 = C0402: Capacitance: 220n; Tolerance: 10; Voltage: 50; Footprint: 0402
FB1 = CMP-08257-000361-1: Signal Line Ferrite Bead 220 Ω 100MHz 500mA DCR 250mΩ AEC-Q200 SMD 0603; DC Resistance (DCR): 250mR; Tolerance: 25%; Number of Lines: 1; Impedance: 220R; Case Code (Metric): 1608; Package Quantity: 4000; Case Code (Imperial): 0603; Max DC Current: 500mA; Mount: Surface Mount; Ratings: AEC-Q200; Test Frequency: 100MHz; RoHS Compliant: Yes; Min Operating Temperature: -55°C; Height: 0.03inch; Packaging: Tape and Reel; Weight: 7.1E-05oz; Max Current Rating: 500mA; Case/Package: 0603; Width: 0.031inch; Termination: SMD/SMT; Max Operating Temperature: 125°C; Length: 0.063inch
P2 = CMP-002-00109-1: High Heat and Vibration Resistance, 05 Size, 2mm pitch Automotive Interface Connector, -40 to 125 ℃, RoHS; RoHS Compliant: Yes
R61 R62 = R0402: Resistance: 10k; Tolerance: 1; Footprint: 0402
U13 = CMP-0784-00464-1: Micropower, Precision Series Mode Voltage Reference, 2.5 V Output, 2.7 to 12 V Supply, Industrial, 3-pin SOT23 (RT-3), Reel; Manufacturer: Analog Devices; Vout: 2.5V; Ref Out TC (ppm/C): 18; ComponentLink2URL: http://www.analog.com/static/imported-files/data_sheets/AD1582_1583_1584_1585.pdf; DatasheetVersion: Rev. I; Mounting Technology: Surface Mount; Packing: Reel; PackageDescription: 3-Pin Small Outline Transistor Package, Body 2.9 x 1.3 mm, Pitch 0.96 mm; ComponentLink3Description: Package Specification; PackageVersion: 011909-C, 02/2009; ComponentLink4Description: URL Link1; PackageReference: RT-3; ComponentLink1URL: http://www.analog.com/en/index.html; PartNumber: AD1582BRTZ-REEL7; ComponentLink1Description: Manufacturer URL; ComponentLink2Description: Datasheet; ComponentLink4URL: Product URL:http://www.analog.com/en/special-linear-functions/voltage-references/ad1582/products/product.html; Operating Temp Range: -40 to 125 degC; Code_JEDEC: TO-236-AB; ComponentLink3URL: http:/www.analog.com/static/imported-files/packages/PKG_PDF/SOT-23-3 (RT)/RT_3.pdf